# EAGLE design Arduino_MEGA2560_ref (EAGLE 9.1.1)
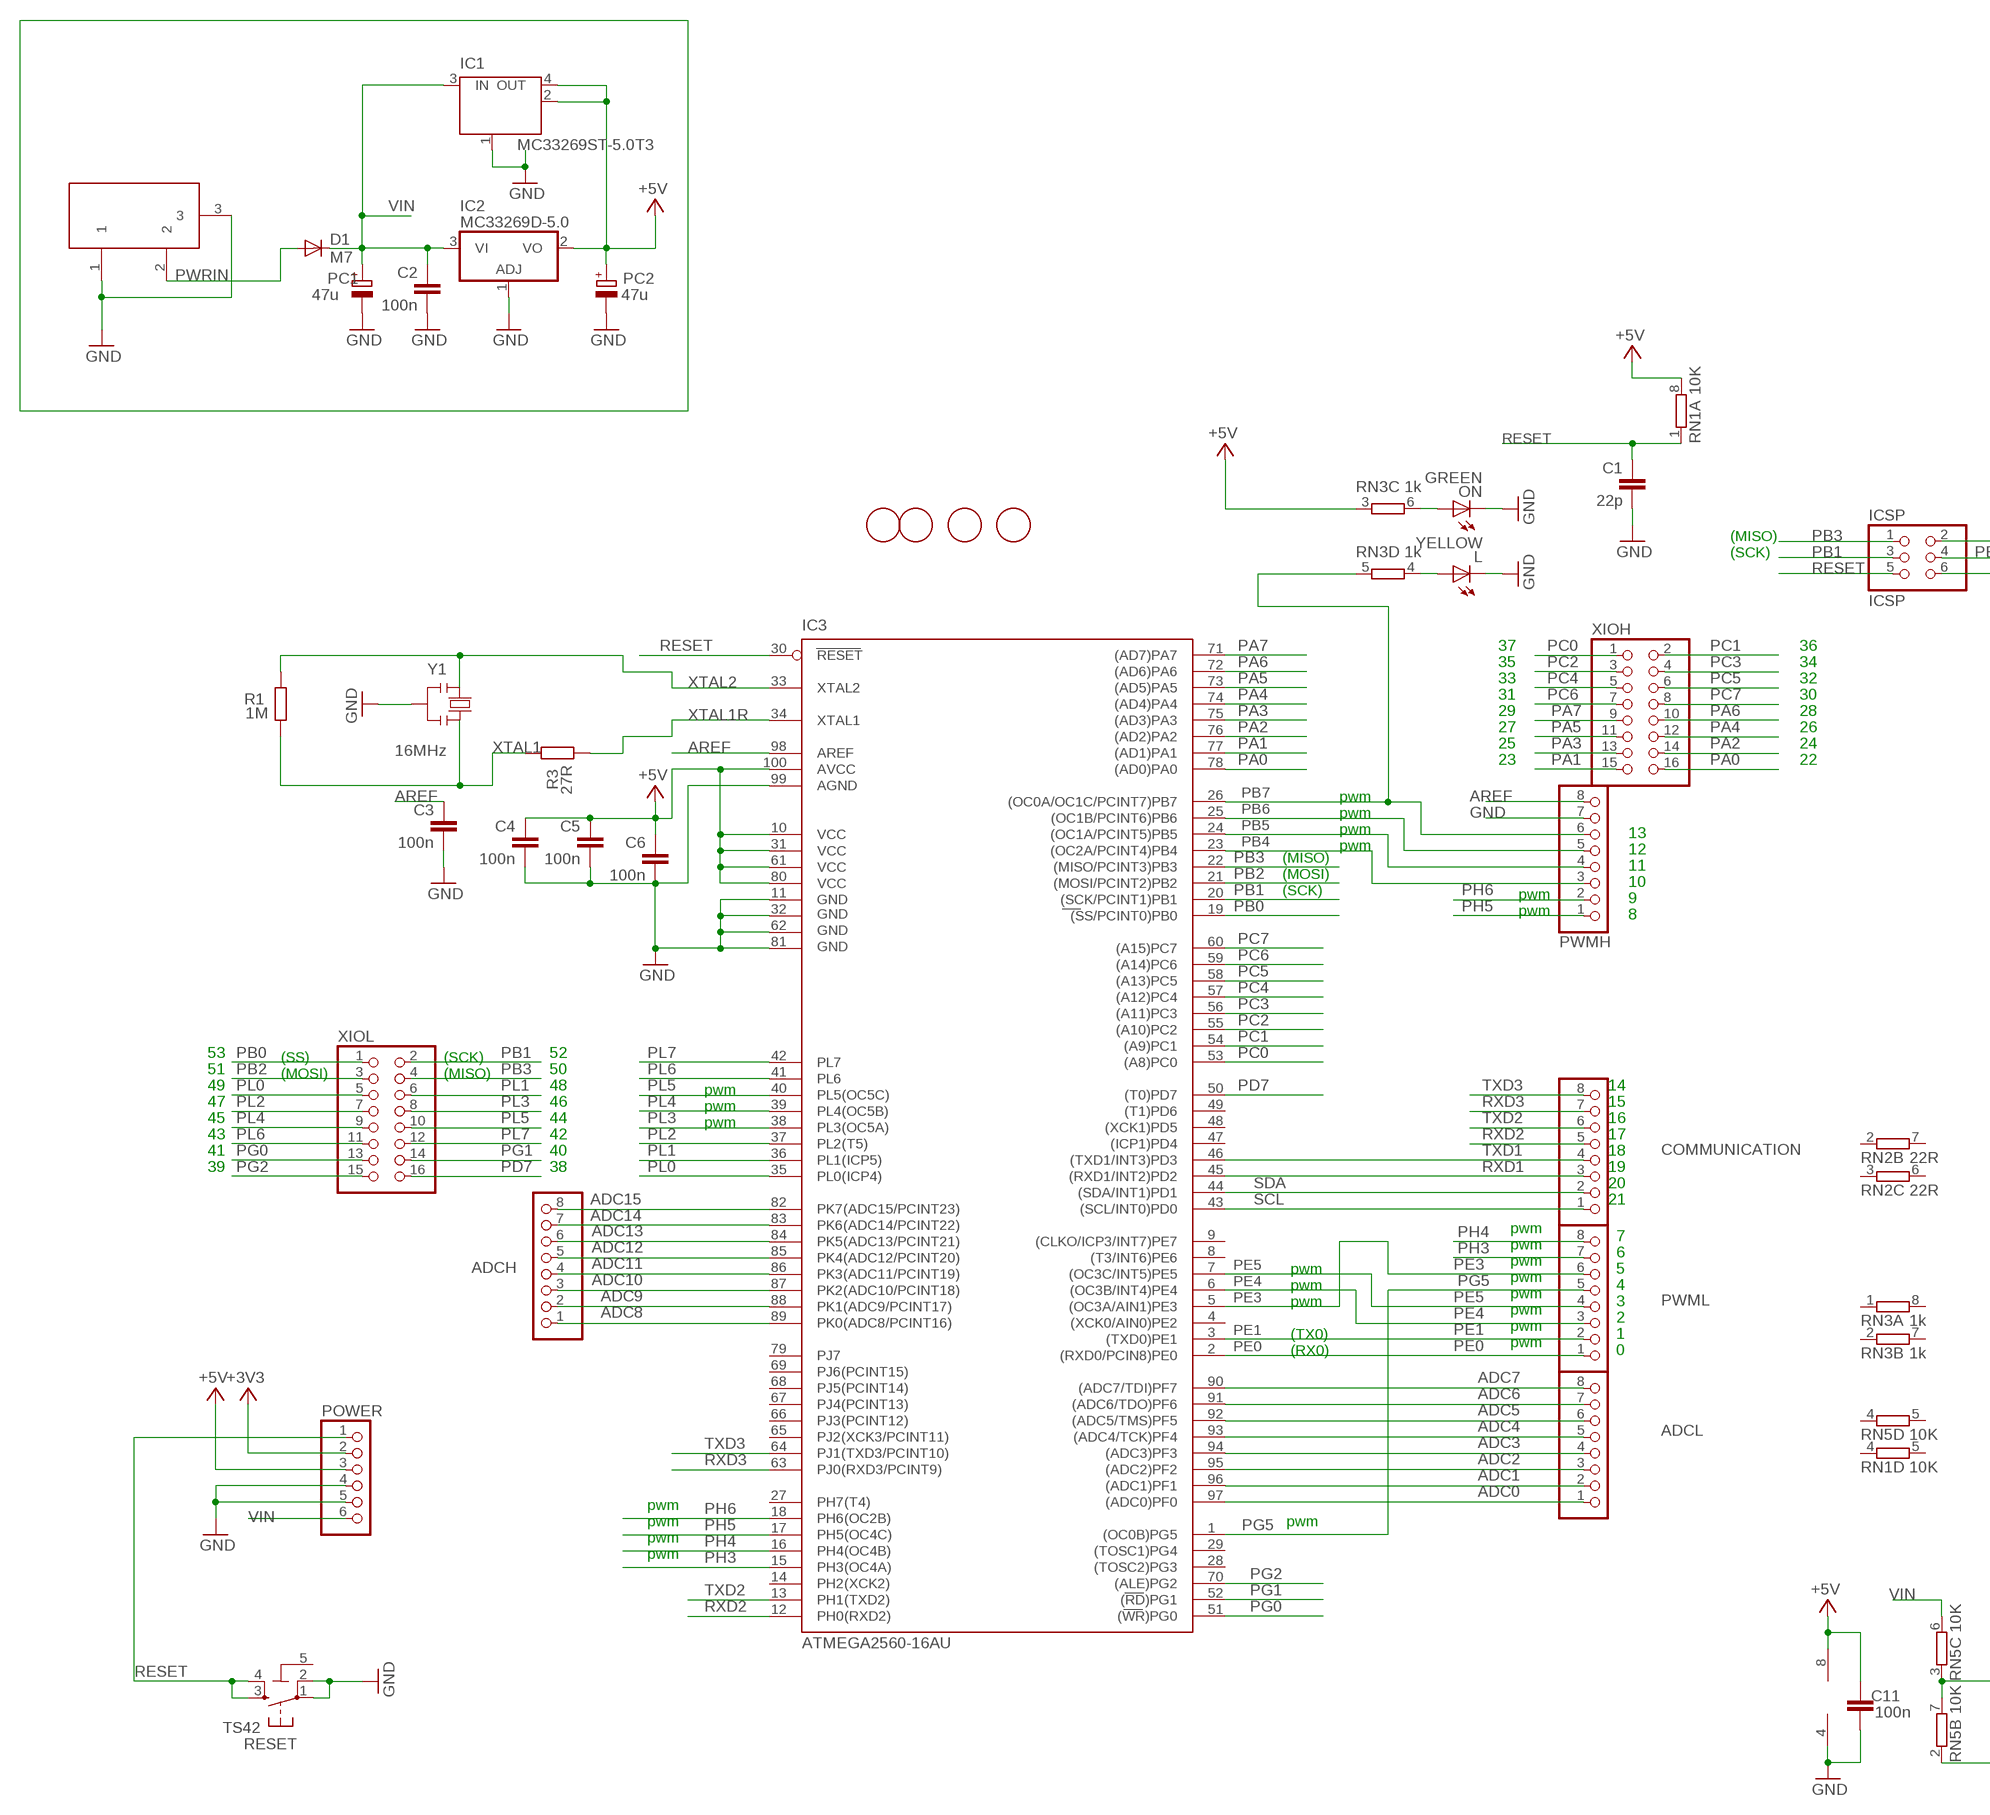
[diagram p0: schematic, sheet 1, part 1 of 2]
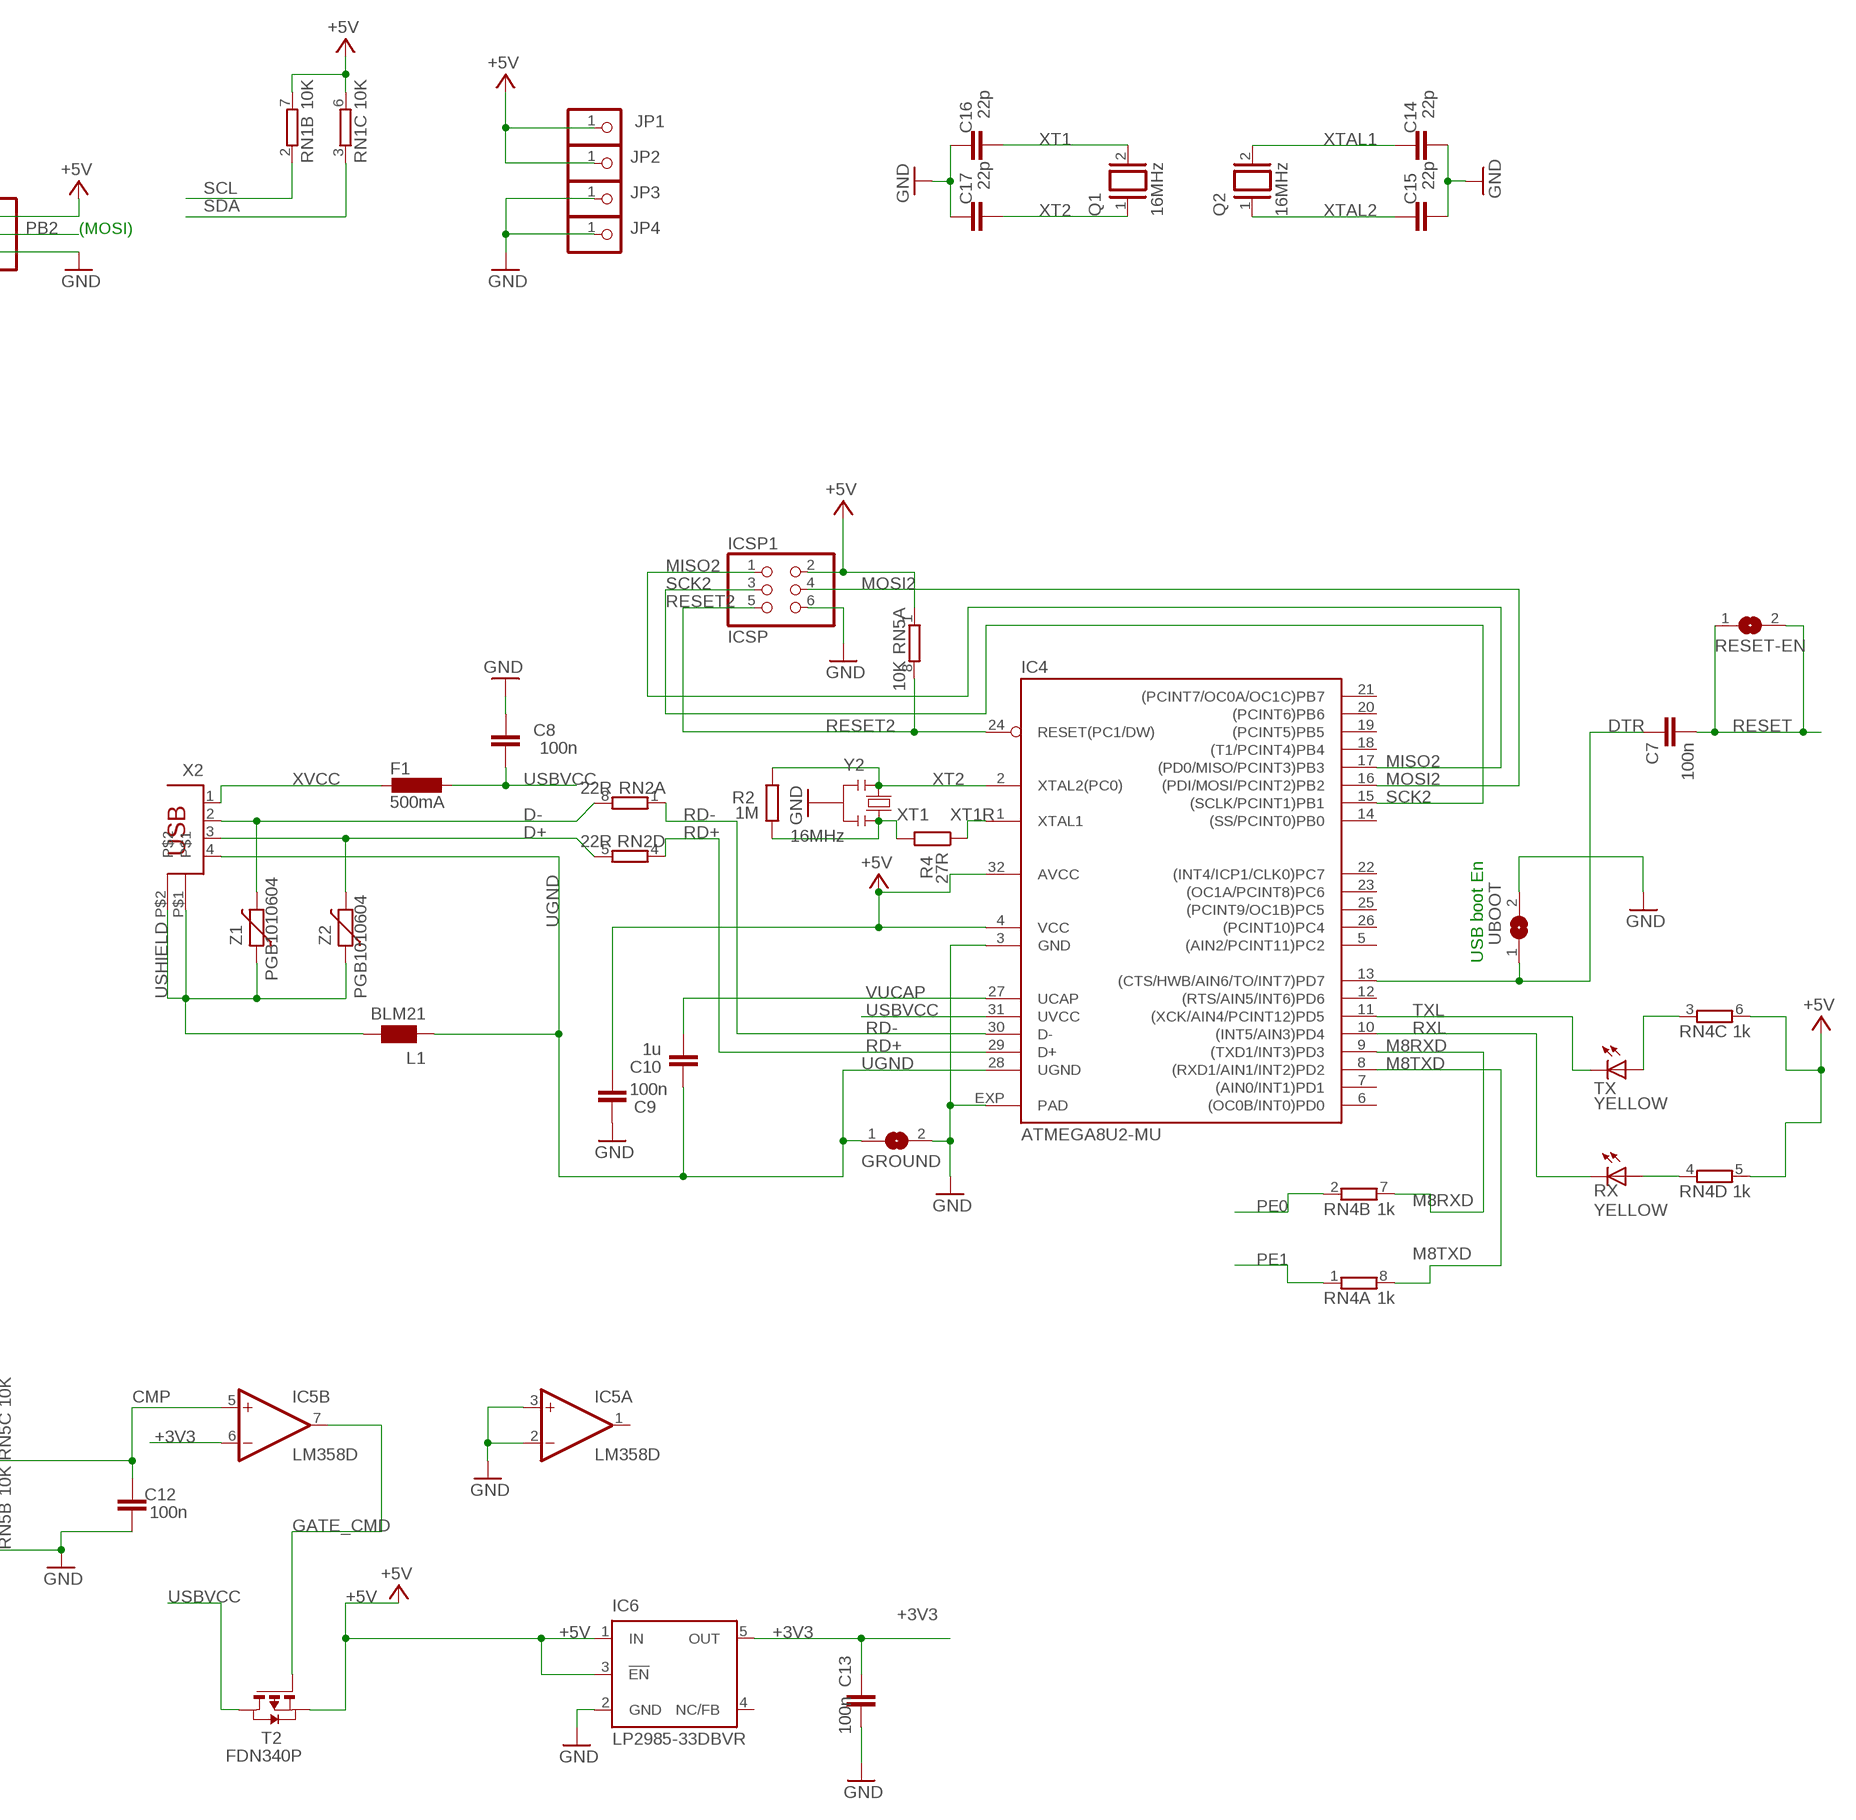
[diagram p1: schematic, sheet 1, part 2 of 2]

## Parts
ADCH  PINHD-1X8  [1X08]
ADCL  PINHD-1X8  [1X08]
C1  22p  C-EU0603-RND  [C0603-ROUND]
C2  100n  C-EU0603-RND  [C0603-ROUND]
C3  100n  C-EU0603-RND  [C0603-ROUND]
C4  100n  C-EU0603-RND  [C0603-ROUND]
C5  100n  C-EU0603-RND  [C0603-ROUND]
C6  100n  C-EU0603-RND  [C0603-ROUND]
C7  100n  C-EU0603-RND  [C0603-ROUND]
C8  100n  C-EUC0603  [C0603]
C9  100n  C-EU0603-RND  [C0603-ROUND]
C10  1u  C-EU0603-RND  [C0603-ROUND]
C11  100n  C-EUC0603  [C0603]
C12  100n  C-EU0603-RND  [C0603-ROUND]
C13  100n  C-EU0603-RND  [C0603-ROUND]
C14  22p  C-EU0603-RND  [C0603-ROUND]
C15  22p  C-EU0603-RND  [C0603-ROUND]
C16  22p  C-EU0603-RND  [C0603-ROUND]
C17  22p  C-EU0603-RND  [C0603-ROUND]
COMMUNICATION  PINHD-1X8  [1X08]
D1  M7  DIODE-SMB  [SMB]
F1  500mA  L-EUL1812  [L1812]
GROUND  SJ  [SJ]
IC1  MC33269ST-5.0T3  MC33269ST-3.3T3  [SOT223]
IC2  MC33269D-5.0  [DPACK]
IC3  ATMEGA2560-16AU  ATMEGA1280-16AU  [TQFP100]
IC4  ATMEGA8U2-MU  [QFN32]
IC5  LM358D  [SO08]
IC6  LP2985-33DBVR  TPS77033  [SOT23-DBV]
ICSP  ICSP  PINHD-2X3  [2X03]
ICSP1  ICSP  PINHD-2X3  [2X03]
JP1  PINHD-1X1  [1X01]
JP2  PINHD-1X1  [1X01]
JP3  PINHD-1X1  [1X01]
JP4  PINHD-1X1  [1X01]
L  YELLOW  LEDCHIP-LED0805  [CHIP-LED0805]
L1  BLM21  WE-CBF_0805  [0805]
ON  GREEN  LEDCHIP-LED0805  [CHIP-LED0805]
PC1  47u  CPOL-EUD  [PANASONIC_D]
PC2  47u  CPOL-EUD  [PANASONIC_D]
POWER  PINHD-1X6  [1X06]
PWMH  PINHD-1X8  [1X08]
PWML  PINHD-1X8  [1X08]
Q1  16MHz  XTAL/S  [QS]
Q2  16MHz  XTAL/S  [QS]
R1  1M  R-EU_R0603  [R0603-ROUND]
R2  1M  R-EU_R0603  [R0603-ROUND]
R3  27R  R-EU_R0603  [R0603-ROUND]
R4  27R  R-EU_R0603  [R0603-ROUND]
RESET  TS42  [TS42]
RESET-EN  SJ  [SJ]
RN1  10K  4R-NCAT16  [CAT16]
RN2  22R  4R-NCAY16  [CAY16]
RN3  1k  4R-NCAY16  [CAY16]
RN4  1k  4R-NCAY16  [CAY16]
RN5  10K  4R-NCAT16  [CAT16]
RX  YELLOW  LEDCHIP-LED0805  [CHIP-LED0805]
T2  FDN340P  PMOSSOT23  [SOT-23]
TX  YELLOW  LEDCHIP-LED0805  [CHIP-LED0805]
U$2  FIDUCIALMOUNT  [FIDUCIA-MOUNT]
U$3  FIDUCIALMOUNT  [FIDUCIA-MOUNT]
U$4  FIDUCIALMOUNT  [FIDUCIA-MOUNT]
U$5  FIDUCIALMOUNT  [FIDUCIA-MOUNT]
UBOOT  SJ  [SJ]
X1  DC21MMX  [DC-21MM]
X2  PN61729  [PN61729]
XIOH  PINHD-2X8  [2X08]
XIOL  PINHD-2X8  [2X08]
Y1  16MHz  RESONATORMU  [RESONATOR]
Y2  16MHz  RESONATORMU  [RESONATOR]
Z1  PGB1010604  VARISTORCN0603  [CT/CN0603]
Z2  PGB1010604  VARISTORCN0603  [CT/CN0603]

## Nets
+3V3: C13.2 IC5.6(B:-IN) IC6.5(OUT) POWER.2
+5V: C4.1 C5.1 C6.1 C9.1 C11.2 IC1.2(OUT) IC1.4(OUT) IC2.2(VO) IC3.10(VCC) IC3.31(VCC1) IC3.61(VCC2) IC3.80(VCC3) IC3.100(AVCC) IC4.4(VCC) IC4.32(AVCC) IC5.8(P:V+) IC6.1(IN) IC6.3(!EN) ICSP1.2 ICSP.2 JP1.1 JP2.1 PC2.+ POWER.3 RN1.6 RN1.7 RN1.8 RN3.3 RN4.5 RN4.6 RN5.1 T2.2(S)
ADC0: ADCL.1 IC3.97((ADC0)PF0)
ADC1: ADCL.2 IC3.96((ADC1)PF1)
ADC2: ADCL.3 IC3.95((ADC2)PF2)
ADC3: ADCL.4 IC3.94((ADC3)PF3)
ADC4: ADCL.5 IC3.93((ADC4/TCK)PF4)
ADC5: ADCL.6 IC3.92((ADC5/TMS)PF5)
ADC6: ADCL.7 IC3.91((ADC6/TDO)PF6)
ADC7: ADCL.8 IC3.90((ADC7/TDI)PF7)
ADC8: ADCH.1 IC3.89(PK0(ADC8/PCINT16))
ADC9: ADCH.2 IC3.88(PK1(ADC9/PCINT17))
ADC10: ADCH.3 IC3.87(PK2(ADC10/PCINT18))
ADC11: ADCH.4 IC3.86(PK3(ADC11/PCINT19))
ADC12: ADCH.5 IC3.85(PK4(ADC12/PCINT20))
ADC13: ADCH.6 IC3.84(PK5(ADC13/PCINT21))
ADC14: ADCH.7 IC3.83(PK6(ADC14/PCINT22))
ADC15: ADCH.8 IC3.82(PK7(ADC15/PCINT23))
AREF: C3.1 IC3.98(AREF) PWMH.8
CMP: C12.2 IC5.5(B:+IN) RN5.3 RN5.7
D+: RN2.5 X2.3 Z2.2
D-: RN2.8 X2.2 Z1.2
DTR: C7.1 IC4.13((CTS/HWB/AIN6/TO/INT7)PD7) UBOOT.1
GATE_CMD: IC5.7(B:OUT) T2.3(G)
GND: C1.2 C2.2 C3.2 C4.2 C5.2 C6.2 C8.2 C9.2 C11.1 C12.1 C13.1 C14.1 C15.1 C16.2 C17.2 GROUND.2 IC1.1(GND/ADJ) IC2.1(ADJ) IC3.11(GND) IC3.32(GND1) IC3.62(GND2) IC3.81(GND3) IC3.99(AGND) IC4.3(GND) IC4.EXP(PAD) IC5.2(A:-IN) IC5.3(A:+IN) IC5.4(P:V-) IC6.2(GND) ICSP1.6 ICSP.6 JP3.1 JP4.1 L.C ON.C PC1.- PC2.- POWER.4 POWER.5 PWMH.7 RESET.1 RESET.2 RN5.2 UBOOT.2 X1.1 X1.3 Y1.2 Y2.2
M8RXD: IC4.9((TXD1/INT3)PD3) RN4.7
M8TXD: IC4.8((RXD1/AIN1/INT2)PD2) RN4.8
MISO2: IC4.17((PD0/MISO/PCINT3)PB3) ICSP1.1
MOSI2: IC4.16((PDI/MOSI/PCINT2)PB2) ICSP1.4
N$2: L.A RN3.4
N$3: ON.A RN3.6
N$54: RN4.4 RX.A
N$55: RN4.3 TX.A
PA0: IC3.78((AD0)PA0) XIOH.16
PA1: IC3.77((AD1)PA1) XIOH.15
PA2: IC3.76((AD2)PA2) XIOH.14
PA3: IC3.75((AD3)PA3) XIOH.13
PA4: IC3.74((AD4)PA4) XIOH.12
PA5: IC3.73((AD5)PA5) XIOH.11
PA6: IC3.72((AD6)PA6) XIOH.10
PA7: IC3.71((AD7)PA7) XIOH.9
PB0: IC3.19((SS/PCINT0)PB0) XIOL.1
PB1: IC3.20((SCK/PCINT1)PB1) ICSP.3 XIOL.2
PB2: IC3.21((MOSI/PCINT2)PB2) ICSP.4 XIOL.3
PB3: IC3.22((MISO/PCINT3)PB3) ICSP.1 XIOL.4
PB4: IC3.23((OC2A/PCINT4)PB4) PWMH.3
PB5: IC3.24((OC1A/PCINT5)PB5) PWMH.4
PB6: IC3.25((OC1B/PCINT6)PB6) PWMH.5
PB7: IC3.26((OC0A/OC1C/PCINT7)PB7) PWMH.6 RN3.5
PC0: IC3.53((A8)PC0) XIOH.1
PC1: IC3.54((A9)PC1) XIOH.2
PC2: IC3.55((A10)PC2) XIOH.3
PC3: IC3.56((A11)PC3) XIOH.4
PC4: IC3.57((A12)PC4) XIOH.5
PC5: IC3.58((A13)PC5) XIOH.6
PC6: IC3.59((A14)PC6) XIOH.7
PC7: IC3.60((A15)PC7) XIOH.8
PD7: IC3.50((T0)PD7) XIOL.16
PE0: IC3.2((RXD0/PCIN8)PE0) PWML.1 RN4.2
PE1: IC3.3((TXD0)PE1) PWML.2 RN4.1
PE3: IC3.5((OC3A/AIN1)PE3) PWML.6
PE4: IC3.6((OC3B/INT4)PE4) PWML.3
PE5: IC3.7((OC3C/INT5)PE5) PWML.4
PG0: IC3.51((WR)PG0) XIOL.13
PG1: IC3.52((RD)PG1) XIOL.14
PG2: IC3.70((ALE)PG2) XIOL.15
PG5: IC3.1((OC0B)PG5) PWML.5
PH3: IC3.15(PH3(OC4A)) PWML.7
PH4: IC3.16(PH4(OC4B)) PWML.8
PH5: IC3.17(PH5(OC4C)) PWMH.1
PH6: IC3.18(PH6(OC2B)) PWMH.2
PL0: IC3.35(PL0(ICP4)) XIOL.5
PL1: IC3.36(PL1(ICP5)) XIOL.6
PL2: IC3.37(PL2(T5)) XIOL.7
PL3: IC3.38(PL3(OC5A)) XIOL.8
PL4: IC3.39(PL4(OC5B)) XIOL.9
PL5: IC3.40(PL5(OC5C)) XIOL.10
PL6: IC3.41(PL6) XIOL.11
PL7: IC3.42(PL7) XIOL.12
PWRIN: D1.A X1.2
RD+: IC4.29(D+) RN2.4
RD-: IC4.30(D-) RN2.1
RESET: C1.1 C7.2 IC3.30(RESET) ICSP.5 POWER.1 RESET-EN.1 RESET-EN.2 RESET.3 RESET.4 RN1.1
RESET2: IC4.24(RESET(PC1/DW)) ICSP1.5 RN5.8
RXD1: COMMUNICATION.3 IC3.45((RXD1/INT2)PD2)
RXD2: COMMUNICATION.5 IC3.12(PH0(RXD2))
RXD3: COMMUNICATION.7 IC3.63(PJ0(RXD3/PCINT9))
RXL: IC4.10((INT5/AIN3)PD4) RX.C
SCK2: IC4.15((SCLK/PCINT1)PB1) ICSP1.3
SCL: COMMUNICATION.1 IC3.43((SCL/INT0)PD0) RN1.2
SDA: COMMUNICATION.2 IC3.44((SDA/INT1)PD1) RN1.3
TXD1: COMMUNICATION.4 IC3.46((TXD1/INT3)PD3)
TXD2: COMMUNICATION.6 IC3.13(PH1(TXD2))
TXD3: COMMUNICATION.8 IC3.64(PJ1(TXD3/PCINT10))
TXL: IC4.11((XCK/AIN4/PCINT12)PD5) TX.C
UGND: C10.2 GROUND.1 IC4.28(UGND) L1.1 X2.4
USBVCC: C8.1 F1.1 IC4.31(UVCC) T2.1(D)
USHIELD: L1.2 X2.P$1 X2.P$2 Z1.1 Z2.1
VIN: C2.1 D1.C IC1.3(IN) IC2.3(VI) PC1.+ POWER.6 RN5.6
VUCAP: C10.1 IC4.27(UCAP)
XT1: C16.1 Q1.2 R2.1 R4.2 Y2.3
XT1R: IC4.1(XTAL1) R4.1
XT2: C17.1 IC4.2(XTAL2(PC0)) Q1.1 R2.2 Y2.1
XTAL1: C14.2 Q2.2 R1.1 R3.2 Y1.3
XTAL1R: IC3.34(XTAL1) R3.1
XTAL2: C15.2 IC3.33(XTAL2) Q2.1 R1.2 Y1.1
XVCC: F1.2 X2.1
Unconnected: IC3.4((XCK0/AIN0)PE2) IC3.8((T3/INT6)PE6) IC3.9((CLKO/ICP3/INT7)PE7) IC3.14(PH2(XCK2)) IC3.27(PH7(T4)) IC3.28((TOSC2)PG3) IC3.29((TOSC1)PG4) IC3.47((ICP1)PD4) IC3.48((XCK1)PD5) IC3.49((T1)PD6) IC3.65(PJ2(XCK3/PCINT11)) IC3.66(PJ3(PCINT12)) IC3.67(PJ4(PCINT13)) IC3.68(PJ5(PCINT14)) IC3.69(PJ6(PCINT15)) IC3.79(PJ7) IC4.5((AIN2/PCINT11)PC2) IC4.6((OC0B/INT0)PD0) IC4.7((AIN0/INT1)PD1) IC4.12((RTS/AIN5/INT6)PD6) IC4.14((SS/PCINT0)PB0) IC4.18((T1/PCINT4)PB4) IC4.19((PCINT5)PB5) IC4.20((PCINT6)PB6) IC4.21((PCINT7/OC0A/OC1C)PB7) IC4.22((INT4/ICP1/CLK0)PC7) IC4.23((OC1A/PCINT8)PC6) IC4.25((PCINT9/OC1B)PC5) IC4.26((PCINT10)PC4) IC5.1(A:OUT) IC6.4(NC/FB) RN1.4 RN1.5 RN2.2 RN2.3 RN2.6 RN2.7 RN3.1 RN3.2 RN3.7 RN3.8 RN5.4 RN5.5

## Notes on the sheet
- (MISO)
- (SCK) | (MOSI)
- 37 | 36
- 35 | 34
- 33 | 32
- 31 | 30
- 29 | 28
- 27 | 26
- 25 | 24
- 23 | 22
- pwm
- pwm
- pwm | 13
- pwm | 12
- (MISO)
- 11
- (MOSI)
- 10
- (SCK) | pwm
- 9
- pwm | 8
- 53 | (SS) | (SCK) | 52
- 51 | (MOSI) | (MISO) | 50
- 49 | 48 | pwm | 14
- 47 | 46 | pwm | 15
- 45 | 44 | pwm | 16
- 43 | 42 | 17
- 41 | 40 | 18
- 39 | 38 | 19
- 20
- 21
- USB boot En
- pwm
- 7
- pwm
- 6
- pwm
- pwm | 5
- pwm
- pwm | 4
- pwm
- pwm | 3
- pwm
- 2
- pwm
- (TX0) | 1
- pwm
- (RX0) | 0
- pwm
- pwm | pwm
- pwm
- pwm

## Power pins joined to a net without a drawn wire
5-GND: RESET.5(5-GND)

## Library data of the parts
ADCH ADCL COMMUNICATION PWMH PWML = pinhead:PINHD-1X8: PIN HEADER
C1-C7 C9 C10 C12-C17 = SmartPrj:C-EU: CAPACITOR, European symbol
C8 C11 = rcl:C-EU: CAPACITOR, European symbol
D1 = diode:DIODE-: DIODE
F1 = rcl:L-EU: INDUCTOR, European symbol
GROUND RESET-EN UBOOT = jumper:SJ: SMD solder JUMPER
IC1 = linear:MC33269ST*: Adjustable Output Low Dropout Voltage Regulator 800 mA Source: http://www.onsemi.com/pub/Collateral/MC33269-D.PDF
IC2 = linear:MC33269?*: Adjustable Output Low Dropout Voltage Regulator 800 mA Source: http://www.onsemi.com/pub/Collateral/MC33269-D.PDF
IC3 = atmel-2005:ATMEGA*: MICROCONTROLLER 64/128/256 Kbytes FLASH 4 Kbytes EEPROM 8 Kbytes SRAM 86 General Purpose I/O pins 12-channels16-bit PWM 4 x Serial USARTs 16-channels 10-bit A/D
IC4 = atmel:ATMEGA8U2-MU
IC5 = linear:LM358: OP AMP also LM158; LM258; LM2904 Source: http://cache.national.com/ds/LM/LM158.pdf
IC6 = texas:TPS770*: ULTRALOW-POWER 50-mA LOW-DROPOUT LINEAR REGULATORS 50-mA Low-Dropout Regulator Source: http://focus.ti.com/lit/ds/symlink/tps77001.pdf
ICSP ICSP1 = pinhead:PINHD-2X3: PIN HEADER
JP1-JP4 = pinhead:PINHD-1X1: PIN HEADER
L ON RX TX = led:LED: LED OSRAM: - CHIPLED LG R971, LG N971, LY N971, LG Q971, LY Q971, LO R971, LY R971 LH N974, LH R974 LS Q976, LO Q976, LY Q976 LO Q996 - Hyper CHIPLED LW Q18S LB Q993, LB Q99A, LB R99A - SideLED LS A670, LO A670, LY A670, LG A670, LP A670 LB A673, LV A673, LT A673, LW A673 LH A674 LY A675 LS A676, LA A676, LO A676, LY A676, LW A676 LS A679, LY A679, LG A679 - Hyper Micro SIDELED® LS Y876, LA Y876, LO Y876, LY Y876 LT Y87S - SmartLED LW L88C, LW L88S LB L89C, LB L89S, LG L890 LS L89K, LO L89K, LY L89K LS L896, LA L896, LO L896, LY L896 - TOPLED LS T670, LO T670, LY T670, LG T670, LP T670 LSG T670, LSP T670, LSY T670, LOP T670, LYG T670 LG T671, LOG T671, LSG T671 LB T673, LV T673, LT T673, LW T673 LH T674 LS T676, LA T676, LO T676, LY T676, LB T676, LH T676, LSB T676, LW T676 LB T67C, LV T67C, LT T67C, LS T67K, LO T67K, LY T67K, LW E67C LS E67B, LA E67B, LO E67B, LY E67B, LB E67C, LV E67C, LT E67C LW T67C LS T679, LY T679, LG T679 LS T770, LO T770, LY T770, LG T770, LP T770 LB T773, LV T773, LT T773, LW T773 LH T774 LS E675, LA E675, LY E675, LS T675 LS T776, LA T776, LO T776, LY T776, LB T776 LHGB T686 LT T68C, LB T68C - Hyper Mini TOPLED® LB M676 - Mini TOPLED Santana® LG M470 LS M47K, LO M47K, LY M47K Source: http://www.osram.convergy.de LUXEON: - LUMILED® LXK2-PW12-R00, LXK2-PW12-S00, LXK2-PW14-U00, LXK2-PW14-V00 LXK2-PM12-R00, LXK2-PM12-S00, LXK2-PM14-U00 LXK2-PE12-Q00, LXK2-PE12-R00, LXK2-PE12-S00, LXK2-PE14-T00, LXK2-PE14-U00 LXK2-PB12-K00, LXK2-PB12-L00, LXK2-PB12-M00, LXK2-PB14-N00, LXK2-PB14-P00, LXK2-PB14-Q00 LXK2-PR12-L00, LXK2-PR12-M00, LXK2-PR14-Q00, LXK2-PR14-R00 LXK2-PD12-Q00, LXK2-PD12-R00, LXK2-PD12-S00 LXK2-PH12-R00, LXK2-PH12-S00 LXK2-PL12-P00, LXK2-PL12-Q00, LXK2-PL12-R00 Source: www.luxeon.com KINGBRIGHT: KA-3528ASYC Source: www.kingbright.com
L1 = wuerth-elektronik:WE-CBF: SMD EMI Suppression Ferrite Beads - excellent anti-EMI properties - low DCR - impedances till 3000 ohms - rated current up to 6 A
PC1 PC2 = rcl:CPOL-EU: POLARIZED CAPACITOR, European symbol
POWER = pinhead:PINHD-1X6: PIN HEADER
Q1 Q2 = special:XTAL/S: CRYSTAL
R1-R4 = SmartPrj:R-EU_: RESISTOR, European symbol
RESET = st-mod v1.4:TS42: TS42 Dongnan Electronics Tact switch VDC 12V - 50mA
RN1-RN5 = resistor-dil:4R-N: Array Chip Resistor Source: RS Component / Phycomp
T2 = zetex:PMOSSOT23: MOS FET
U$2-U$5 = SmartPrj:FIDUCIALMOUNT
X1 = powersupply:DC21MM
X2 = SmartPrj:PN61729: BERG USB connector
XIOH XIOL = pinhead:PINHD-2X8: PIN HEADER
Y1 Y2 = SmartPrj:RESONATOR
Z1 Z2 = varistor:VARISTOR: VARISTOR

## Net classes
0 default: width 0.15 mm, drill 0.3 mm, clearance 0.15 mm

## Board
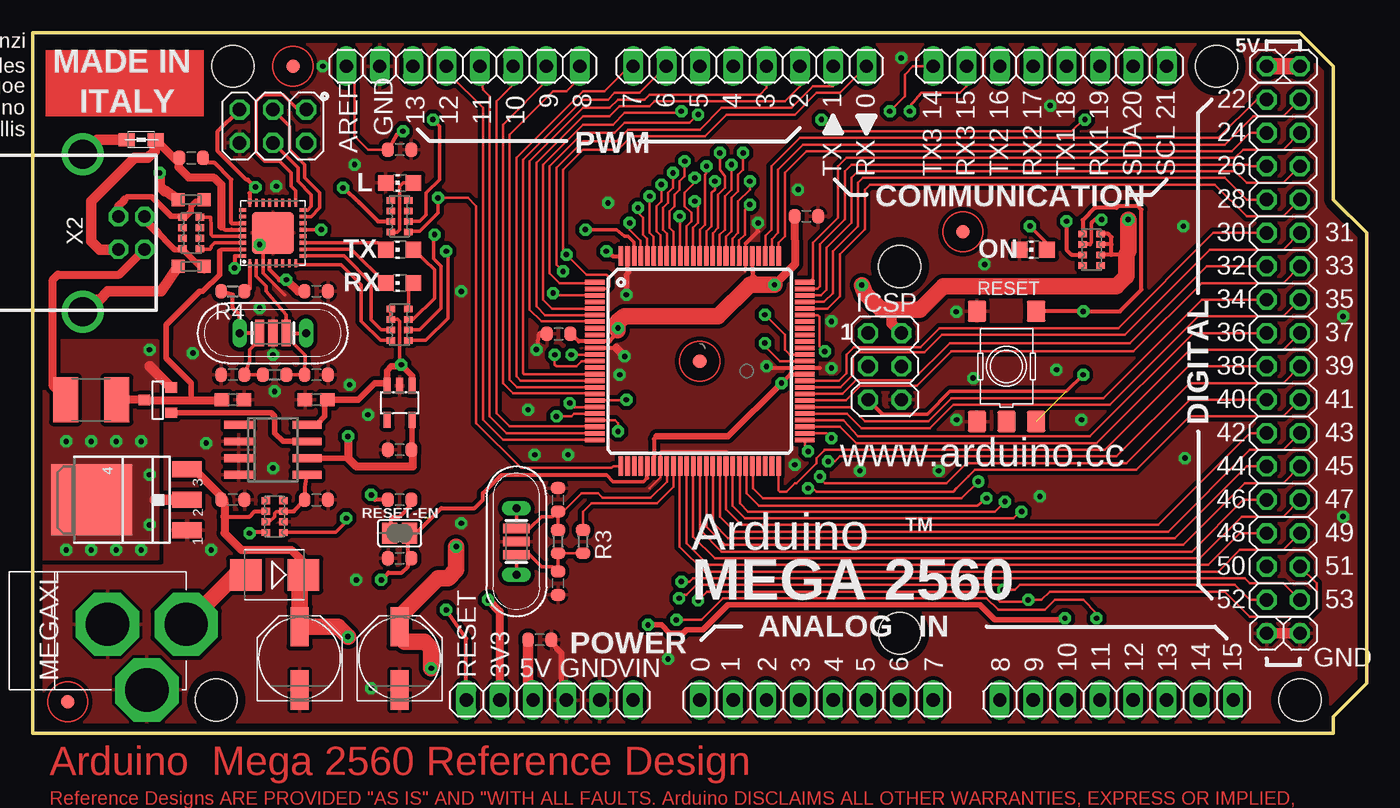
[diagram p2: board, top side]
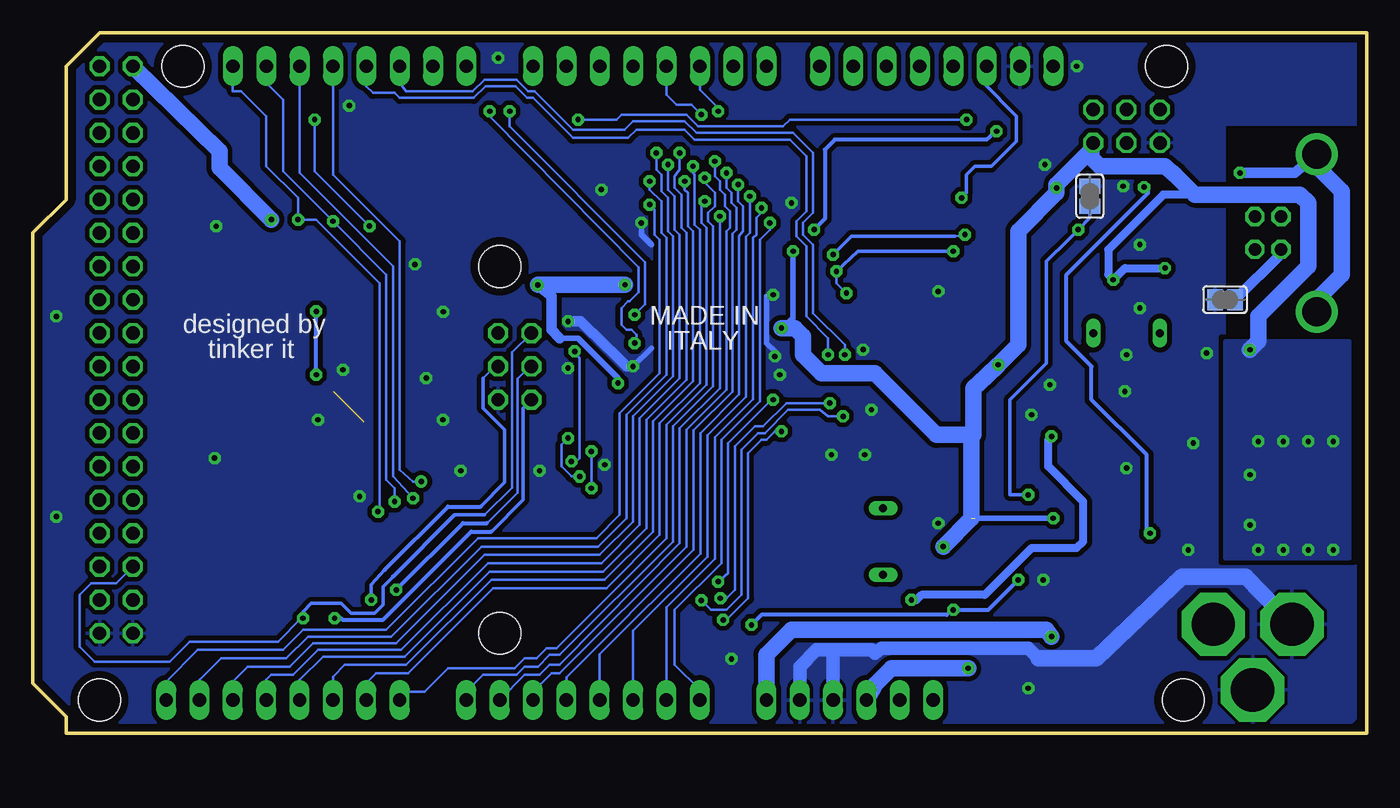
[diagram p3: board, bottom side, seen from below]

Size 101.6 x 53.34 mm. Coordinates in mm from the lower left corner, seen from the top.
Outline: 0,53.34 96.52,53.34 99.06,50.8 99.06,40.64 101.6,38.1 101.6,3.81 99.06,1.27 99.06,0 0,0 0,53.34
Copper layers (1*16): Top 0.035mm / dielectric 1.5mm / Bottom 0.035mm
Design rules "default *": minimum track width 0.15mm, minimum drill 0.3mm, track to track 0.15mm, track to pad 0.15mm, pad to pad 0.15mm, via to via 0.15mm, smd to smd 0.15mm, copper to edge 0.6mm, drill to drill 0.3mm, minimum pad ring 10mil, minimum via ring 10mil, stop-mask expansion 2mil, vias tented up to drill 1mil, thermal gap 10mil
Holes 3.2 mm at 96.52,2.54 15.24,50.8 90.17,50.8 13.97,2.54 66.04,35.56 66.04,7.62

### Footprints (pad centres in the part's own frame; a part is rotated, then mirrored left to right if it is on the bottom)
1X08 = drill 1.016 long: 1 -8.89,0; 2 -6.35,0; 3 -3.81,0; 4 -1.27,0; 5 1.27,0; 6 3.81,0; 7 6.35,0; 8 8.89,0
C0603-ROUND = smd 0.898 x 1.1: 1 -0.889,0; 2 0.889,0
C0603 = smd 1.1 x 1: 1 -0.85,0; 2 0.85,0
SMB = smd 2.4 x 2.4: A 2.2,0; C -2.2,0
L1812 = smd 1.9 x 3.4: 1 -1.95,0; 2 1.95,0
SJ = smd 1.168 x 1.6: 1 -0.762,0; 2 0.762,0
SOT223 = smd 1.219 x 2.235: 1 -2.311,-3.099; 2 0,-3.099; 3 2.311,-3.099 | smd 3.6 x 2.2: 4 0,3.099
DPACK = smd 1 x 1.6: 1 -2.28,-4.8; 3 2.28,-4.8 | smd 5.4 x 6.2: 2 0,2.5
TQFP100 = smd 1.5 x 0.35: 1 -8,6; 2 -8,5.5; 3 -8,5; 4 -8,4.5; 5 -8,4; 6 -8,3.5; 7 -8,3; 8 -8,2.5; 9 -8,2; 10 -8,1.5; 11 -8,1; 12 -8,0.5; 13 -8,0; 14 -8,-0.5; 15 -8,-1; 16 -8,-1.5; 17 -8,-2; 18 -8,-2.5; 19 -8,-3; 20 -8,-3.5; 21 -8,-4; 22 -8,-4.5; 23 -8,-5; 24 -8,-5.5; 25 -8,-6; 51 8,-6; 52 8,-5.5; 53 8,-5; 54 8,-4.5; 55 8,-4; 56 8,-3.5; 57 8,-3; 58 8,-2.5; 59 8,-2; 60 8,-1.5; 61 8,-1; 62 8,-0.5; 63 8,0; 64 8,0.5; 65 8,1; 66 8,1.5; 67 8,2; 68 8,2.5; 69 8,3; 70 8,3.5; 71 8,4; 72 8,4.5; 73 8,5; 74 8,5.5; 75 8,6 | smd 0.35 x 1.5: 26 -6,-8; 27 -5.5,-8; 28 -5,-8; 29 -4.5,-8; 30 -4,-8; 31 -3.5,-8; 32 -3,-8; 33 -2.5,-8; 34 -2,-8; 35 -1.5,-8; 36 -1,-8; 37 -0.5,-8; 38 0,-8; 39 0.5,-8; 40 1,-8; 41 1.5,-8; 42 2,-8; 43 2.5,-8; 44 3,-8; 45 3.5,-8; 46 4,-8; 47 4.5,-8; 48 5,-8; 49 5.5,-8; 50 6,-8; 76 6,8; 77 5.5,8; 78 5,8; 79 4.5,8; 80 4,8; 81 3.5,8; 82 3,8; 83 2.5,8; 84 2,8; 85 1.5,8; 86 1,8; 87 0.5,8; 88 0,8; 89 -0.5,8; 90 -1,8; 91 -1.5,8; 92 -2,8; 93 -2.5,8; 94 -3,8; 95 -3.5,8; 96 -4,8; 97 -4.5,8; 98 -5,8; 99 -5.5,8; 100 -6,8
QFN32 = smd 0.6 x 0.3: 1 -2.3,1.75; 2 -2.3,1.25; 3 -2.3,0.75; 4 -2.3,0.25; 5 -2.3,-0.25; 6 -2.3,-0.75; 7 -2.3,-1.25; 8 -2.3,-1.75; 17 2.3,-1.75; 18 2.3,-1.25; 19 2.3,-0.75; 20 2.3,-0.25; 21 2.3,0.25; 22 2.3,0.75; 23 2.3,1.25; 24 2.3,1.75 | smd 0.3 x 0.6: 9 -1.75,-2.3; 10 -1.25,-2.3; 11 -0.75,-2.3; 12 -0.25,-2.3; 13 0.25,-2.3; 14 0.75,-2.3; 15 1.25,-2.3; 16 1.75,-2.3; 25 1.75,2.3; 26 1.25,2.3; 27 0.75,2.3; 28 0.25,2.3; 29 -0.25,2.3; 30 -0.75,2.3; 31 -1.25,2.3; 32 -1.75,2.3 | smd 3.2 x 3.2: EXP 0,0
SO08 = smd 0.6 x 2.2: 1 -1.905,-2.6; 2 -0.635,-2.6; 3 0.635,-2.6; 4 1.905,-2.6; 5 1.905,2.6; 6 0.635,2.6; 7 -0.635,2.6; 8 -1.905,2.6
SOT23-DBV = smd 0.55 x 1.2: 1 -0.95,-1.3; 2 0,-1.3; 3 0.95,-1.3; 4 0.95,1.3; 5 -0.95,1.3
2X03 = drill 1.016 octagon: 1 -2.54,-1.27; 2 -2.54,1.27; 3 0,-1.27; 4 0,1.27; 5 2.54,-1.27; 6 2.54,1.27
1X01 = drill 1.016 octagon: 1 0,0
CHIP-LED0805 = smd 1.2 x 1.2: A 0,-1.05; C 0,1.05
0805 = smd 1.2 x 1: 1 -1.1,0; 2 1.1,0
PANASONIC_D = smd 3 x 1.4: + 2.4,0; - -2.4,0
1X06 = drill 1.016 long: 1 -6.35,0; 2 -3.81,0; 3 -1.27,0; 4 1.27,0; 5 3.81,0; 6 6.35,0
QS = drill 0.61 long: 1 -2.54,0; 2 2.54,0
R0603-ROUND = smd 0.898 x 1.1: 1 -0.889,0; 2 0.889,0
TS42 = smd 1.6 x 1.4: 1 -4.2,2.25; 2 4.2,2.25; 3 -4.2,-2.25; 4 4.2,-2.25; 5 -4.2,0
CAT16 = smd 0.5 x 0.65: 1 -1.2,-0.675; 2 -0.4,-0.675; 3 0.4,-0.675; 4 1.2,-0.675; 5 1.2,0.675; 6 0.4,0.675; 7 -0.4,0.675; 8 -1.2,0.675
CAY16 = smd 0.5 x 0.65: 1 -1.2,-0.675; 2 -0.4,-0.675; 3 0.4,-0.675; 4 1.2,-0.675; 5 1.2,0.675; 6 0.4,0.675; 7 -0.4,0.675; 8 -1.2,0.675
SOT-23 = smd 0.787 x 0.889: 1 0.025,-1.016; 2 -0.94,1.016; 3 0.991,1.016
FIDUCIA-MOUNT = smd 1.016 x 1.016: P$1 0,0
DC-21MM = drill 3.302 pad 4.826 octagon: 1 -5.08,-3.353; 2 -0.076,-6.35; 3 -0.076,-0.356
PN61729 = drill 0.95 octagon: 1 1.25,4.71; 2 -1.25,4.71; 3 -1.25,2.71; 4 1.25,2.71 | drill 2.2: P$1 -6,0; P$2 6,0
2X08 = drill 1.016 octagon: 1 -8.89,-1.27; 2 -8.89,1.27; 3 -6.35,-1.27; 4 -6.35,1.27; 5 -3.81,-1.27; 6 -3.81,1.27; 7 -1.27,-1.27; 8 -1.27,1.27; 9 1.27,-1.27; 10 1.27,1.27; 11 3.81,-1.27; 12 3.81,1.27; 13 6.35,-1.27; 14 6.35,1.27; 15 8.89,-1.27; 16 8.89,1.27
RESONATOR = smd 0.7 x 2: 1 -1,0; 2 0,0; 3 1,0
CT/CN0603 = smd 1 x 1: 1 -1,0; 2 1,0

### Placement (x,y rotation side)
ADCH  82.55,2.54 0 top
ADCL  59.69,2.54 0 top
C1  27.94,13.34 180 top
C2  15.24,17.78 0 top
C3  27.94,44.45 0 top
C4  38.61,7.11 0 top
C5  58.93,39.37 0 top
C6  40.05,30.42 180 top
C7  27.94,17.78 0 top
C8  15.24,25.4 0 top
C9  21.59,33.66 0 top
C10  12.06,43.81 180 top
C11  21.59,25.4 0 top
C12  21.59,17.78 180 top
C13  27.94,21.59 0 top
C14  40.01,11.43 90 top
C15  40.01,17.78 270 top
C16  15.24,27.3 180 top
C17  21.59,27.3 0 top
COMMUNICATION  77.47,50.8 180 top
D1  18.41,12.06 180 top
F1  4.45,25.4 180 top
GROUND  10.79,33.02 180 bottom
IC1  8.64,17.78 90 top
IC2  6.99,17.78 90 top
IC3  50.8,28.35 0 top
IC4  18.29,38.1 90 top
IC5  18.29,21.59 270 top
IC6  27.94,25.17 180 top
ICSP  64.9,27.94 270 top
ICSP1  18.29,46.23 180 top
JP1  93.98,50.8 0 top
JP2  96.52,50.8 0 top
JP3  93.98,7.62 0 top
JP4  96.52,7.62 0 top
L  27.94,41.91 90 top
L1  8.26,45.21 180 top
ON  76.2,36.83 90 top
PC1  20.32,5.71 90 top
PC2  27.94,5.71 90 top
POWER  39.37,2.54 0 top
PWMH  32.77,50.8 180 top
PWML  54.61,50.8 180 top
Q1  18.29,30.48 180 top
Q2  36.83,14.61 270 top
R1  40.01,14.61 90 top
R2  18.41,27.3 0 top
R3  41.91,14.61 270 top
R4  15.24,33.66 180 top
RESET  74.17,27.94 90 top
RESET-EN  27.94,15.24 0 top
RN1  80.64,36.83 270 top
RN2  12.06,38.1 90 top
RN3  27.94,39.37 270 top
RN4  27.94,31.11 90 top
RN5  18.41,16.51 90 top
RX  27.94,34.29 90 top
T2  9.53,25.4 270 top
TX  27.94,36.83 90 top
U$2  70.84,38.19 0 top
U$3  2.67,2.41 0 top
U$4  19.81,50.8 0 top
U$5  50.8,28.35 0 top
UBOOT  21.08,40.89 90 bottom
X1  5.33,8.38 90 top
X2  3.81,38.1 270 top
XIOH  95.25,39.37 90 top
XIOL  95.25,19.05 90 top
Y1  36.83,14.61 270 top
Y2  18.29,30.48 180 top
Z1  12.06,35.56 0 top
Z2  12.06,40.64 0 top

### Tracks (layer width: path | path; a pad name or v marks a point on that pad's centre or on a via)
+3V3  (via drill 0.41)
  Top 0.406: 28.89,21.62 IC6.5 | 24,20.95 IC5.6
  Top 0.61: POWER.2 35.56,9.27 v34.67,10.16 | 28.89,21.62 C13.2 28.96,21.55 28.96,20.32 24.64,20.32 24,20.95 v24,22.61
  Bottom 0.61: v34.67,10.16 34.29,10.16 33.91,10.54 29.08,10.54 25.53,14.1 22.1,14.1 21.59,14.61 21.59,17.65 24.26,20.32 24.26,22.35 v24,22.61
+5V  (via drill 0.41)  (1 unrouted)
  Top 0.254: IC3.80 54.81,36.3 54.79,36.27 54.81,36.25 54.81,35.41 | 57.66,27.3 57.7,27.35 | v28.07,28.07 28,28.19 27.94,28.64 27.94,31.37 27.79,31.52 RN4.6 RN4.5 | v23.88,16.38 23.88,16.13 23.06,15.31 RN5.1
  Top 0.305: 54.86,34.67 54.86,35.1 54.81,35.15 54.81,35.41 | 57.7,27.35 IC3.61 | v57.02,26.67 57.66,27.3 | 44.45,30.48 43.94,29.85 IC3.10 41.59,29.85 C6.1 | IC3.100 44.17,36.35 v43.69,36.7 | IC4.32 15.39,36.35 v15.37,35.43 | IC4.4 18.04,35.3 18.8,34.54 | RN1.8 81.92,38.03 82.17,37.78 82.17,37.21 | 83.31,36.45 82.17,36.45 | v23.62,41.53 24.89,40.39 26.29,38.99 27.25,38.99 RN3.3 | IC3.31 47.3,22.41 47.5,22.61 | RN1.6 82.15,36.43 82.17,36.45 | 82.17,36.45 82.17,37.21 | RN1.7 82.15,37.23 82.17,37.21
  Top 0.406: 44.55,30.7 44.45,30.48 v44.58,30.86 | IC5.8 21.65,23.55 22.23,24.13 22.23,25.18 C11.2 | v19.3,34.54 18.8,34.54
  Top 0.508: 47.5,22.61 52.96,22.61 v57.02,26.67 | C11.2 24.77,25.4 26.04,26.67 26.96,26.67 IC6.3 26.99,27.62 27.3,27.94 27.94,27.94 | IC6.1 28.89,27.24 v28.07,28.07
  Top 0.61: v28.07,28.07 27.94,27.94 | 54.86,34.67 54.86,34.29 54.99,34.16 | C5.1 58.08,35.75 v56.49,34.16 | C9.1 20.19,33.66 v19.3,34.54
  Top 0.813: 9.27,17.78 IC1.2 | C4.1 37.72,3.94 POWER.3 | 83.31,34.8 83.31,34.92 | 65.41,32.26 65.41,31.24 ICSP.2 | T2.2 10.49,26.34 8.89,27.94
  Top 1.27: JP1.1 JP2.1 | v63.14,34.14 63.37,33.53 64.64,32.26 65.41,32.26 67.56,32.26 69.34,34.04 82.55,34.04 83.31,34.8 | 83.31,34.92 83.31,36.45 83.44,36.7 v83.44,39.12 | 44.55,30.7 44.55,31.34 45.09,31.75 52.2,31.75 54.61,34.16 54.99,34.16 v56.49,34.16 | v32.26,14.22 32.26,12.45 31.62,11.81 30.86,11.81 27.94,8.89 PC2.+ 27.94,7.37 28.32,6.99 29.84,6.99 30.35,6.48 v30.35,4.95
  Bottom 0.254: 23.62,41.78 23.88,41.53
  Bottom 0.305: 15.37,43.18 14.48,43.05 | 23.88,41.53 v23.62,41.53
  Bottom 0.406: v44.58,30.86 44.58,30.73 43.69,31.62 v43.69,36.7 | 61.47,30.1 60.07,30.1 57.02,27.05 v57.02,26.67 | v23.88,16.38 29.84,16.38
  Bottom 0.61: 63.12,34.16 v63.14,34.14 | 13.08,41.02 15.49,41.02 19.68,36.83 19.68,34.92 v19.3,34.54 18.41,35.43 v15.37,35.43
  Bottom 0.813: 61.47,30.1 62.1,30.73 62.1,33.27 v63.14,34.14
  Bottom 1.27: v30.35,4.95 36.2,4.95 37.47,3.68 POWER.3 | v56.49,34.16 63.12,34.16 | v44.58,30.86 43.56,30.86 42.93,30.23 42.93,28.83 41.53,27.43 37.47,27.43 32.77,22.73 30.1,22.73 | JP1.1 87.38,44.32 87.38,43.05 v83.44,39.12 | 20.95,44.45 20.95,43.81 20.32,43.18 15.37,43.18 14.61,42.55 13.08,41.02 5.08,41.02 4.45,40.39 4.45,35.56 8.26,31.75 8.26,29.84 v8.89,29.21 | 20.95,44.45 20.95,44.83 ICSP1.2 | 20.95,44.45 23.62,41.78 23.62,41.15 26.54,38.23 26.54,29.59 v28.07,28.07 28.96,27.18 29.97,26.29 29.97,22.73 30.1,22.73 | 30.1,22.73 30.1,16.38 v32.26,14.22
  other vias: 6.35,22.23 4.45,22.23 8.26,22.23 2.54,22.23 8.89,19.68 2.54,13.97 6.35,13.97 4.45,13.97 8.89,15.88 8.26,13.97
  pour Top (isolate 0.305, no thermals): 9.53,13.34 9.53,29.84 0.64,29.84 0.64,13.34
  pour Bottom: 1.27,13.34 1.27,29.84 10.79,29.84 10.79,13.34
ADC0  (via drill 0.41)
  Top 0.203: IC3.97 46.3,37.52 45.47,38.35 v45.47,38.86
  Bottom 0.203: ADCL.1 50.8,3.3 52.7,5.21 52.7,9.4 49.15,12.95 49.15,22.35 46.23,25.27 46.23,37.59 45.47,38.35 v45.47,38.86
ADC1  (via drill 0.41)
  Top 0.203: IC3.96 46.8,37.66 46.48,37.97 46.48,39.24 46.1,39.62 v46.1,40.01
  Bottom 0.203: ADCL.2 53.34,9.6 49.63,13.31 49.63,22.55 46.74,25.45 46.74,37.72 46.48,37.97 46.48,39.24 46.1,39.62 v46.1,40.01
ADC2  (via drill 0.41)
  Top 0.203: v46.99,40.89 46.99,38.1 47.27,37.82 47.27,36.68 47.37,36.58 47.3,36.51 47.3,36.38 47.27,36.35 | 47.27,36.35 47.24,36.32 | 47.27,36.35 IC3.95
  Bottom 0.203: ADCL.3 55.88,7.8 50.22,13.46 50.22,22.68 47.27,25.63 47.27,37.82 46.99,38.1 v46.99,40.89
ADC3  (via drill 0.41)
  Top 0.203: IC3.94 47.8,37.92 47.5,38.23 47.5,40.13 47.88,40.51 v47.88,41.78
  Bottom 0.203: ADCL.4 58.42,2.74 58.52,2.85 58.52,3.05 58.42,3.15 58.42,6.02 50.75,13.69 50.75,22.86 47.8,25.81 47.8,37.85 47.75,37.97 47.5,38.23 47.5,40.13 47.88,40.51 v47.88,41.78
ADC4  (via drill 0.41)
  Top 0.203: IC3.93 48.3,38.06 48.01,38.35 48.01,40.01 48.39,40.39 48.39,41.15 48.77,41.53 v48.77,42.67
  Bottom 0.203: 60.96,2.44 ADCL.5 60.96,4.27 51.26,13.97 51.26,23.06 48.31,26.01 48.31,38.05 48.01,38.35 48.01,40.01 48.39,40.39 48.39,41.15 48.77,41.53 v48.77,42.67
ADC5  (via drill 0.41)
  Top 0.203: IC3.92 48.8,38.2 48.51,38.48 48.51,39.75 48.9,40.13 48.9,41.02 49.28,41.4 49.28,42.04 49.66,42.42 v49.66,43.56
  Bottom 0.203: v49.66,43.56 49.66,42.42 49.28,42.04 49.28,41.4 48.9,41.02 48.9,40.13 48.51,39.75 48.51,38.48 48.77,38.23 48.77,26.16 51.82,23.11 51.82,14.22 61.47,4.57 62.1,4.57 63.5,3.17 ADCL.6
ADC6  (via drill 0.41)
  Top 0.203: IC3.91 49.3,39.35 v49.28,39.37
  Bottom 0.203: v49.28,39.37 49.28,26.29 52.32,23.24 52.32,14.48 61.47,5.21 62.23,5.21 62.99,4.45 64.14,4.45 ADCL.7
ADC7  (via drill 0.41)
  Top 0.203: IC3.90 49.8,38.62 50.16,38.99 50.16,39.62 49.66,40.13 49.66,41.15 50.42,41.91 v50.42,42.29
  Bottom 0.203: v50.42,42.29 50.42,41.91 49.66,41.15 49.66,40.13 50.16,39.62 50.16,38.99 49.78,38.61 49.78,26.42 52.83,23.37 52.83,14.61 61.47,5.97 62.23,5.97 63.12,5.08 64.14,5.08 64.77,4.45 67.31,4.45 68.58,3.17 | 68.58,3.17 ADCL.8 | 68.58,3.17 68.58,3.94
ADC8  (via drill 0.41)
  Top 0.203: IC3.89 50.3,38.49 50.67,38.86 50.67,40.26 v50.42,40.51
  Bottom 0.203: v50.42,40.51 50.67,40.26 50.67,38.86 50.29,38.48 50.29,26.54 53.34,23.5 53.34,14.86 61.72,6.48 62.48,6.48 63.25,5.71 64.14,5.71 64.9,4.95 69.98,4.95 71.75,3.17 73.66,3.17 ADCH.1
ADC9  (via drill 0.41)
  Top 0.203: IC3.88 50.8,38.35 51.18,38.73 51.18,42.55 51.31,42.67 v51.31,43.18
  Bottom 0.203: v51.31,43.18 51.31,42.67 51.18,42.55 51.18,38.73 50.8,38.35 50.8,26.67 53.85,23.62 53.85,15.11 57.91,11.05 66.55,11.05 73.03,4.57 75.44,4.57 76.2,3.81 ADCH.2
ADC10  (via drill 0.41)
  Top 0.203: IC3.87 51.3,38.22 51.69,38.61 51.69,41.15 51.94,41.4 v51.94,42.04
  Bottom 0.203: v51.94,42.04 51.94,41.4 51.69,41.15 51.69,38.61 51.31,38.23 51.31,26.8 54.36,23.75 54.36,15.37 58.04,11.68 66.67,11.68 73.15,5.21 77.85,5.21 78.74,4.32 ADCH.3
ADC11  (via drill 0.41)
  Top 0.203: IC3.86 51.8,38.08 52.2,38.48 52.2,41.02 52.7,41.53 52.7,42.42 52.32,42.93 v52.32,44.2
  Bottom 0.203: v52.32,44.2 52.32,42.93 52.7,42.42 52.7,41.53 52.2,41.02 52.2,38.48 51.82,38.1 51.82,26.92 54.86,23.88 54.86,15.62 58.17,12.32 66.8,12.32 73.28,5.84 79.5,5.84 81.28,4.06 ADCH.4
ADC12  (via drill 0.41)
  Top 0.203: IC3.85 52.3,37.95 52.7,38.35 52.7,40.89 53.21,41.4 v53.21,43.31
  Bottom 0.203: v53.21,43.31 53.21,41.4 52.7,40.89 52.7,38.35 52.32,37.97 52.32,27.05 55.37,24 55.37,15.88 58.29,12.95 66.93,12.95 73.53,6.35 79.88,6.35 81.79,4.45 83.44,4.45 83.82,4.06 ADCH.5
ADC13  (via drill 0.41)
  Top 0.203: IC3.84 52.8,37.81 53.21,38.23 53.21,40.77 53.72,41.27 53.72,42.55 54.1,42.93 v54.1,44.2
  Bottom 0.203: v54.1,44.2 54.1,42.93 53.72,42.55 53.72,41.27 53.21,40.77 53.21,38.23 52.83,37.85 52.83,27.18 55.88,24.13 55.88,16.13 58.42,13.59 67.18,13.59 73.91,6.86 80.26,6.86 82.04,5.08 85.22,5.08 86.36,3.94 ADCH.6
ADC14  (via drill 0.41)
  Top 0.203: IC3.83 53.3,37.68 53.72,38.1 53.72,40.51 54.61,41.4 v54.61,42.04
  Bottom 0.203: v54.61,42.04 54.61,41.4 53.72,40.51 53.72,38.1 53.34,37.72 53.34,27.3 56.39,24.26 56.39,16.38 58.55,14.22 67.44,14.22 74.3,7.37 80.64,7.37 82.3,5.71 87.25,5.71 88.9,4.06 ADCH.7
ADC15  (via drill 0.41)
  Top 0.203: IC3.82 53.8,37.54 54.23,37.97 54.23,39.88 v54.61,40.26
  Bottom 0.203: v54.61,40.26 54.23,39.88 54.23,37.97 53.85,37.59 53.85,27.43 56.9,24.38 56.9,16.64 58.67,14.86 67.69,14.86 74.68,7.87 81.03,7.87 82.55,6.35 89.03,6.35 91.44,3.94 ADCH.8
AREF  (via drill 0.41)
  Top 0.203: C3.1 25.53,44.45 24.51,45.47 24.51,49.4 PWMH.8
  Top 0.254: IC3.98 45.8,37.38 45.34,37.85 45.09,37.85 44.45,38.35 v42.09,38.35
  Top 0.305: v28.19,45.85 27.73,45.59 C3.1
  Bottom 0.305: PWMH.8 24.13,50.55 | v28.19,45.85 28.96,45.21 40.51,45.21 41.27,44.45 41.27,39.17 v42.09,38.35
CMP
  Top 0.254: RN5.7 18.02,16.11 18.41,16.51 18.41,16.76 18.54,16.89 19.07,16.89
  Top 0.305: IC5.5 20.74,18.77 C12.2 19.87,16.91 RN5.3 19.07,16.89
D+
  Top 0.406: 6.99,40.64 7.2,40.85 9.06,40.85 10.54,39.37 11.32,39.37 RN2.5 11.61,39.3 12.06,39.75 12.06,40.13 12.45,40.51 12.94,40.51 Z2.2
  Top 0.61: X2.3 6.52,40.17 6.99,40.64
D-
  Top 0.406: 9.53,38.1 9.56,38.1 10.03,37.63 10.03,37.59 10.79,36.83 11.32,36.83 RN2.8 13.06,35.23 Z1.2
  Top 0.61: X2.2 8.53,39.1 9.53,38.1
DTR  (via drill 0.41)
  Top 0.254: v21.97,38.35 IC4.13
  Top 0.305: C7.1 26.04,17.78 v25.78,18.16
  Bottom 0.254: v25.78,18.16 27.18,18.16 27.18,25.4 24.38,28.19 24.38,35.94 22.73,37.59 22.73,37.58 v21.97,38.35 21.08,39.24 UBOOT.1
GATE_CMD
  Top 0.406: T2.3 18.14,24.41 18.41,24.13 18.41,22.86 19.05,22.23 IC5.7
GND  (via drill 0.41)
  Top 0.203: 54.23,35.18 54.3,35.25 IC3.81 54.33,36.35 | 54.3,37.28 54.3,36.38 54.33,36.35 | IC3.32 47.8,21.39 47.88,21.46 52.83,21.46 | IC3.32 | IC3.32 47.8,19.48 46.99,18.67 | 54.33,36.35 54.36,36.32
  Top 0.254: 17.54,37.35 IC4.3 17.54,35.04 19.18,33.4
  Top 0.305: 45.39,35.1 45.29,35.2 IC3.99 | IC3.11 42.86,29.35 42.88,29.36 44.32,29.36 | 44.32,29.36 44.4,29.36 | 56.06,27.86 56.08,27.84 58.81,27.84 | 58.83,27.84 58.82,27.85 IC3.62 58.81,27.84 | 54.3,37.28 55.24,38.23 v55.24,38.86 | 44.32,29.36 44.32,29.34 44.35,29.36 44.42,29.36 | v38.35,29.23 38.61,30.48 | 59.94,27.81 59.92,27.84 58.81,27.84 | v17.27,37.21 IC4.EXP
  Top 0.406: C4.2 39.88,6.48 40.26,6.1 40.26,3.94 POWER.4 | 56.06,27.86 56.01,27.81 v55.88,27.94 | v45.21,33.4 45.21,34.92 45.39,35.1 | v17.27,37.21 17.53,37.21 18.41,38.1
  Top 0.61: v55.88,27.94 55.88,27.81 | 44.42,29.36 v45.09,28.7
  Top 0.813: JP3.1 JP4.1
  Bottom 0.305: GROUND.2 10.16,33.02
  Bottom 0.406: v45.09,28.7 45.09,29.08 45.72,29.72 45.72,33.27 v45.21,33.4 | v55.24,38.86 55.24,37.97 54.48,37.21 | v55.88,27.94 54.48,29.34
  Bottom 0.813: v60.83,31.37 59.87,31.37 58.98,30.48 58.93,30.48 56.39,27.94 v55.88,27.94 | 93.73,7.87 JP3.1
  Bottom 1.016: 25.02,5.71 25.78,6.48 36.96,6.48 37.47,6.1 37.72,6.35 40.64,6.35 | POWER.5 43.18,5.08 41.91,6.35 40.64,6.35 | 40.64,6.35 POWER.4
  Bottom 1.27: 25.02,5.71 20.57,5.71 14.1,11.94 9.2,11.94 X1.3
  other vias: 18.41,26.04 69,20 38.23,21.21 32.64,33.66 87.63,38.61 87.76,20.95 72.49,35.71 24.64,11.68 13.59,13.97 32.64,16 40.77,21.21 18.54,41.66 25.53,24.26 58.29,41.4 77.5,47.8 43.81,40.39 44.7,27.3 48.39,5.67 25.78,3.43 13.21,22.1 24.13,26.54 24.51,43.31 60.83,27.81 58.04,20.45 12.19,28.96 37.72,24.64 77.98,27.69 76.71,18.04 99.81,31.75 79.88,23.88 70.36,23.88 71.63,27.05 18.29,28.83 70.34,32.1 63,20 17.27,32.38 99.81,16.51 66.15,51.44 22.08,50.8 18.29,20.19
  pour Top (isolate 0.305, rank 2): 0.64,52.7 101.6,52.7 101.6,0.64 0.64,0.64 0.64,29.84 10.79,29.84 10.79,46.35 0.64,46.35
  pour Bottom (isolate 0.356, rank 2): 0.64,52.7 101.6,52.7 102.23,52.07 102.23,0.64 1.27,0.64 0.64,1.27 0.64,29.84 10.79,29.84 10.79,46.35 0.64,46.35
M8RXD
  Top 0.254: IC4.9 23.72,36.35 25.78,34.29 25.78,31.5 26.54,30.73 27.25,30.73 RN4.7
M8TXD
  Top 0.254: RN4.8 26.47,29.91 25.02,31.37 25.02,34.16 23.5,35.69 20.15,35.69 IC4.8
MISO2
  Top 0.254: IC4.17 20.04,41.3 19.68,41.66 19.68,42.67 18.8,43.56 17.65,43.56 17.02,44.2 17.02,48.13 17.53,48.64 19.05,48.64 20.19,47.5 ICSP1.1
MOSI2
  Top 0.254: IC4.16 20.93,39.85 21.21,40.13 21.21,41.02 20.19,42.04 20.19,43.05 ICSP1.4
N$2
  Top 0.254: RN3.4 27.76,38.17 27.94,38.35 27.94,41.66 28.19,41.91 L.A
N$3  (via drill 0.41)
  Top 0.203: 77.22,37.08 ON.A | v80.14,46.74 80.01,46.74 79.12,45.85 60.96,45.85 v60.07,46.74
  Top 0.254: v30.48,46.74 30.99,46.23 30.99,42.16 29.97,41.15 29.97,39.5 29.46,38.99 28.63,38.99 RN3.6 | 77.22,37.08 77.22,37.37 v75.96,38.62
  Bottom 0.203: v75.96,38.62 80.14,42.8 v80.14,46.74 | v60.07,46.74 57.15,46.74 56.77,47.12 51.82,47.12 50.93,46.23 44.45,46.23 43.94,46.74 v30.48,46.74
N$54
  Top 0.254: RN4.4 28.61,33.82 RX.A
N$55
  Top 0.254: RN4.3 28.98,31.52 30.61,33.15 30.61,35.31 TX.A
PA0
  Top 0.203: IC3.78 55.8,37.89 56.26,38.35 56.26,43.18 58.42,45.34 90.3,45.34 93.22,48.26 XIOH.16
PA1
  Top 0.203: IC3.77 56.3,37.63 56.77,38.1 56.77,42.93 58.67,44.83 90.81,44.83 92.96,46.99 95.25,46.99 XIOH.15
PA2
  Top 0.203: XIOH.14 92.71,45.72 91.31,44.32 58.93,44.32 57.28,42.67 57.28,37.85 56.8,37.37 IC3.76
PA3
  Top 0.203: XIOH.13 95.25,44.45 92.2,44.45 91.57,43.81 61.98,43.81 61.34,43.18 61.34,39.26 59.44,37.35 59.44,34.67 59.11,34.35 IC3.75
PA4
  Top 0.203: IC3.74 59.75,33.85 59.94,34.04 59.94,37.23 61.85,39.13 61.85,42.8 62.36,43.31 92.58,43.31 92.71,43.18 XIOH.12
PA5
  Top 0.203: IC3.73 60.02,33.35 60.45,33.78 60.45,36.97 62.36,38.88 62.36,42.29 62.87,42.8 91.57,42.8 92.46,41.91 95.25,41.91 XIOH.11
PA6
  Top 0.203: IC3.72 60.28,32.85 60.96,33.53 60.96,36.72 62.87,38.62 62.87,41.91 63.25,42.29 90.81,42.29 92.46,40.64 XIOH.10
PA7
  Top 0.203: IC3.71 60.54,32.35 61.47,33.27 61.47,36.47 63.37,38.37 63.37,41.4 63.75,41.78 90.04,41.78 92.46,39.37 95.25,39.37 XIOH.9
PB0  (via drill 0.41)
  Top 0.203: IC3.19 45.39,25.35 v45.21,25.4 | v49.4,11.56 50.04,11.56 50.29,11.81 92.33,11.81 92.71,11.43 95.25,11.43 XIOL.1
  Bottom 0.203: v45.21,25.4 45.34,25.4 48.64,22.1 48.64,12.19 v49.4,11.56
PB1  (via drill 0.41)
  Top 0.203: IC3.20 41.19,24.85 v40.89,25.15 | XIOL.2 92.71,10.16 91.57,11.3 75.18,11.3 74.8,10.92 v73.91,10.92 73.53,11.3 50.55,11.3 49.78,10.54 49.48,10.54 v49.23,10.29
  Bottom 0.203: v40.89,25.15 44.2,25.15 45.97,23.37 46.61,23.37 48.13,21.84 48.13,10.92 48.77,10.29 v49.23,10.29 | 63.75,27.94 64.69,27 64.69,18.31 67,16
  Bottom 0.254: 63.75,27.94 ICSP.3
  Bottom 0.305: 67,16 68.83,16 v73.91,10.92
PB2  (via drill 0.41)
  Top 0.203: IC3.21 41.24,24.35 41.02,24.13 v39.88,24.13 | XIOL.3 97.79,11.43 97.79,9.53 97.16,8.89 92.71,8.89 90.81,10.79 77.47,10.79 76.83,10.16 v75.82,10.16 75.69,10.03 73.66,10.03 72.9,10.79 51.34,10.79 v50.67,10.12
  Bottom 0.203: v39.88,24.13 41.02,24.13 41.66,24.64 44.07,24.64 45.85,22.86 46.35,22.86 47.62,21.59 47.62,10.54 48.77,9.4 49.95,9.4 v50.67,10.12 | ICSP.4 66.42,27.94 67.31,27.05
  Bottom 0.254: 67.31,27.05 67.31,24.77 65.66,23.11 65.66,19.11 67.49,17.27 | 74.8,12.45 75.82,11.3 v75.82,10.16
  Bottom 0.305: 67.49,17.27 69.98,17.27 74.8,12.45
PB3  (via drill 0.41)
  Top 0.203: IC3.22 44.35,23.85 44.58,23.62 v44.58,22.99 | v81.03,8.76 81.03,9.14 80.01,10.16 77.85,10.16 77.09,9.4 73.53,9.4 72.64,10.29 52.58,10.29 50.93,8.64 v49.02,8.64
  Bottom 0.203: v81.03,8.76 81.15,8.76 82.93,6.99 89.66,6.99 91.19,5.46 96.9,5.46 98.04,6.6 98.04,10.54 97.16,11.43 95.25,11.43 XIOL.4 | v44.58,22.99 45.09,22.99 45.72,22.35 46.1,22.35 47.12,21.34 47.12,10.29 48.77,8.64 v49.02,8.64 | ICSP.1 65.1,29.01 65.1,18.72 67.18,16.64
  Bottom 0.254: v81.03,8.76 81.03,9.27 80.39,9.91 78.11,9.91 77.34,9.14 75.56,9.14 74.93,9.78 74.93,11.18 74.17,11.94 | 69.47,16.64 67.18,16.64
  Bottom 0.305: 74.17,11.94 69.47,16.64
PB4
  Top 0.203: PWMH.3 36.83,49.66 35.31,48.13 35.31,24.38 36.32,23.37 42.93,23.37 42.9,23.35 IC3.23
PB5
  Top 0.203: IC3.24 36.08,22.85 34.8,24.13 34.8,48.51 34.29,49.02 PWMH.4
PB6
  Top 0.203: IC3.25 42.92,22.35 42.93,22.35 35.81,22.35 34.29,23.88 34.29,47.62 31.75,50.16 PWMH.5
PB7  (via drill 0.41)
  Top 0.203: IC3.26 44.22,20.34 44.09,20.22 37.19,20.22 33.78,23.62 33.78,40.13 33.15,40.77 v30.86,40.77
  Top 0.254: v30.86,40.77 30.86,39.62 29.46,38.23 28.67,38.23 RN3.5
  Bottom 0.254: PWMH.6 29.21,49.53 26.67,46.99 26.67,45.09 28.57,43.18 29.84,43.18 30.48,42.55 30.48,41.15 v30.86,40.77
PC0
  Top 0.203: IC3.53 61.49,23.35 62.74,22.1 81.03,22.1 88.14,29.21 95.25,29.21 XIOH.1
PC1
  Top 0.203: IC3.54 61.75,23.85 62.87,22.61 80.52,22.61 88.39,30.48 XIOH.2
PC2
  Top 0.203: IC3.55 62.01,24.35 63.12,23.24 68.33,23.24 70.1,25.02 82.04,25.02 88.77,31.75 95.25,31.75 XIOH.3
PC3
  Top 0.203: IC3.56 62.28,24.85 63.37,23.75 68.2,23.75 69.98,25.53 81.53,25.53 89.03,33.02 XIOH.4
PC4
  Top 0.203: IC3.57 61.92,25.35 63.04,26.47 67.36,26.47 69.98,29.08 83.82,29.08 89.03,34.29 95.25,34.29 XIOH.5
PC5
  Top 0.203: IC3.58 61.66,25.85 62.69,26.87 67,26.87 69.85,29.72 83.57,29.72 89.41,35.56 XIOH.6
PC6
  Top 0.203: IC3.59 61.52,26.35 62.48,27.3 62.48,28.7 62.79,29.01 67.89,29.01 69.24,30.35 83.19,30.35 89.66,36.83 95.25,36.83 XIOH.7
PC7
  Top 0.203: IC3.60 61.39,26.85 61.98,27.43 61.98,28.83 62.56,29.41 67.61,29.41 69.06,30.86 69.34,30.86 69.85,30.86 82.68,30.86 89.92,38.1 XIOH.8
PD7
  Top 0.203: XIOL.16 88.01,27.94 81.66,21.59 60.3,21.59 60.3,21.57 59.69,20.95 59.69,20.57 58.17,19.05 58.04,19.05 57.4,18.41 56.9,18.41 56.8,18.51 IC3.50
PE0  (via drill 0.41)
  Top 0.203: PWML.1 61.47,48.77 59.69,48.77 58.04,47.12 52.83,47.12 51.18,45.47 45.59,45.47 44.58,44.45 41.91,44.45 40.39,42.93 40.39,36.7 v40.64,36.45 42.16,34.92 43.69,34.92 43.94,34.67 43.94,34.04 43.75,33.85 IC3.2
  Top 0.254: v30.61,37.97 30.54,37.9 30.54,36.12 31.11,35.56 31.11,32.38 29.46,30.73 28.63,30.73 RN4.2
  Bottom 0.203: v30.61,37.97 31.37,37.85
  Bottom 0.254: 31.37,37.85 39.24,37.85 v40.64,36.45
PE1  (via drill 0.41)
  Top 0.203: v40.39,35.18 39.88,35.69 39.88,43.05 41.91,45.09 44.45,45.09 45.34,45.97 50.8,45.97 52.45,47.62 57.78,47.62 59.44,49.28 60.96,49.28 PWML.2 | v39.62,33.53 39.88,33.27 39.95,33.35 IC3.3
  Top 0.254: RN4.1 29.91,29.91 31.62,31.62 31.62,36.32 v31.5,36.7
  Bottom 0.203: v40.39,35.18 40.39,34.29 v39.62,33.53
  Bottom 0.254: v31.5,36.7 38.73,36.7 v40.39,35.18
PE3  (via drill 0.41)
  Top 0.203: IC3.5 39.54,32.35 38.86,33.02 38.86,43.31 41.91,46.35 44.2,46.35 45.09,47.24 49.28,47.24 v49.4,47.37
  Bottom 0.203: v49.4,47.37 49.4,47.62 50.8,49.02 50.8,50.55 50.67,50.67 PWML.6
PE4
  Top 0.203: IC3.6 39.02,31.85 38.35,32.51 38.35,43.43 41.91,46.99 43.94,46.99 44.7,47.75 46.99,47.75 47.37,48.13 57.28,48.13 58.42,49.28 PWML.3
PE5
  Top 0.203: IC3.7 42.78,31.35 42.55,31.37 38.73,31.37 37.85,32.26 37.85,43.56 41.91,47.62 43.94,47.62 44.58,48.26 46.61,48.26 46.99,48.64 55.37,48.64 55.88,49.15 PWML.4
PG0  (via drill 0.41)
  Top 0.203: IC3.51 58.8,21.84 v59.05,21.46 | XIOL.13 95.25,24.13 88.14,24.13 84.07,20.07 71.75,20.07 71.25,19.56 70.36,18.67 70.1,18.41 59.69,18.41 59.44,18.67 v59.05,18.67
  Bottom 0.203: v59.05,18.67 v59.05,21.46
PG1  (via drill 0.41)
  Top 0.203: IC3.52 60.44,22.85 v60.83,22.48 | XIOL.14 88.14,25.4 83.31,20.57 71.12,20.57 69.6,19.05 60.33,19.05 59.94,19.43 v59.94,19.56
  Bottom 0.203: v59.94,19.56 60.58,19.56 61.34,20.32 61.34,21.97 v60.83,22.48
PG2  (via drill 0.41)
  Top 0.203: IC3.70 59.8,31.85 59.92,31.73 59.92,29.49 v60.33,29.08 | v60.58,20.7 61.09,20.7 61.47,21.08 82.55,21.08 88.14,26.67 95.25,26.67 XIOL.15
  Bottom 0.203: v60.58,20.7 60.2,20.7 59.94,20.95 59.94,28.57 v60.33,29.08
PG5  (via drill 0.41)
  Top 0.203: IC3.1 42.73,34.35 42.67,34.29 40.13,34.29 39.37,35.05 39.37,43.18 41.91,45.72 44.32,45.72 45.09,46.48 50.04,46.48 v50.67,47.12
  Bottom 0.203: PWML.5 53.34,48.64 52.58,47.88 51.44,47.88 v50.67,47.12
PH3
  Top 0.203: IC3.15 37.42,27.35 37.34,27.43 37.34,43.69 41.91,48.26 43.81,48.26 44.32,48.77 46.23,48.77 PWML.7
PH4
  Top 0.203: IC3.16 37.16,26.85 36.83,27.18 36.83,43.81 41.91,48.9 43.56,48.9 45.72,51.05 PWML.8
PH5
  Top 0.203: IC3.17 36.9,26.35 36.32,26.92 36.32,45.59 39.62,48.9 40.64,48.9 41.91,50.16 PWMH.1
PH6
  Top 0.203: PWMH.2 39.37,49.91 35.81,46.35 35.81,26.67 36.58,25.91 42.67,25.91 42.73,25.85 IC3.18
PL0
  Top 0.203: 49.28,20.3 49.28,14.22 51.18,12.32 90.3,12.32 91.95,13.97 95.25,13.97 XIOL.5
  Top 0.254: IC3.35 49.3,20.32 49.28,20.3
PL1
  Top 0.203: IC3.36 49.8,14.46 51.44,12.83 89.53,12.83 91.95,15.24 XIOL.6
PL2
  Top 0.203: 50.29,20.3 50.29,14.99 51.94,13.34 88.9,13.34 92.08,16.51 95.25,16.51 XIOL.7
  Top 0.254: IC3.37 50.27,20.32 50.29,20.3
PL3
  Top 0.203: IC3.38 50.8,15.49 52.45,13.84 88.27,13.84 92.2,17.78 XIOL.8
PL4
  Top 0.203: 51.31,20.22 51.31,15.75 52.7,14.35 87.63,14.35 92.33,19.05 95.25,19.05 XIOL.9
  Top 0.254: IC3.39 51.3,20.28 51.33,20.24 51.31,20.22
PL5
  Top 0.203: IC3.40 51.8,16.02 52.96,14.86 87,14.86 92.46,20.32 XIOL.10
PL6
  Top 0.203: 52.32,20.24 52.32,16.51 53.47,15.37 86.49,15.37 92.71,21.59 95.25,21.59 XIOL.11
  Top 0.254: IC3.41 52.3,20.32 52.27,20.3 52.32,20.24
PL7
  Top 0.203: IC3.42 52.8,17.05 53.98,15.88 85.72,15.88 92.71,22.86 XIOL.12
PWRIN
  Top 1.27: D1.A 15.44,12.06 X1.2
RD+
  Top 0.254: IC4.29 13.71,37.85 13.59,37.97 13.59,38.61 13.53,39.3 RN2.4
RD-
  Top 0.254: IC4.30 13.86,37.35 13.59,37.08 13.59,36.96 13.5,36.87 12.77,36.87 RN2.1
RESET  (via drill 0.41)  (1 unrouted)
  Top 0.254: 46.8,19.44 46.53,19.18 44.2,19.18 43.69,19.68 | 64.72,24.31 68.12,24.31 69.85,26.04 78.74,26.04 v80.01,27.3
  Top 0.305: POWER.1 33.02,7.24 v31.5,9.4 | 46.8,19.44 IC3.30 | ICSP.5 64.72,24.31 | RN1.1 79.97,39.08 80.9,40.01 82.55,40.01 82.68,40.13 84.2,40.13 84.45,39.88 84.45,33.78 82.8,32.13 v80.01,32.13 RESET.4 | 43.69,19.68 35.69,19.68 34.29,18.29 34.29,17.78 33.66,17.14 31.11,17.14 29.21,15.24 RESET-EN.2 | C7.2 28.79,17.36 27.94,16.51 27.3,16.51 27.3,15.37 RESET-EN.1 RESET-EN.2 | RESET-EN.2 28.57,15.11 28.57,13.55 C1.1 28.57,13.12 28.57,12.7 28.11,12.23 27.09,12.23 v26.54,11.68
  Top 0.406: v46.85,8.26 47.88,8.26 48.51,7.62 49.53,7.62 49.78,7.87 51.05,7.87 52.96,9.78 72.14,9.78 73.28,8.64 78.49,8.64 v78.61,8.76
  Bottom 0.254: 63.75,25.27 64.26,24.77 64.26,17.78 66.67,15.37
  Bottom 0.305: v78.61,8.76 78.11,8.76 77.98,8.64 74.93,8.64 68.2,15.37 66.67,15.37 | 63.75,25.27 ICSP.5 | v46.85,8.26 46.1,9.02 32,9.02 v31.5,9.4 28.83,9.4 v26.54,11.68 | v80.01,27.3 v80.01,32.13
RESET2  (via drill 0.41)
  Top 0.305: v16.95,41.59 16.51,41.15 16.51,40.43 IC4.24 | v16.95,41.59 17.02,41.66 | ICSP1.5 14.1,45.85 14.1,44.32 16.26,42.16 16.38,42.16 v16.95,41.59 | RN5.8 16.58,15.31 v16.51,15.24
  Bottom 0.305: v16.95,41.59 16.64,41.27 16.64,41.15 22.86,34.92 22.86,29.84 20.95,27.94 20.95,25.4 16.76,21.21 16.76,15.24 v16.51,15.24
RXD1  (via drill 0.41)
  Top 0.203: IC3.45 54.33,20.35 54.36,20.32 54.36,18.29 55.3,17.35 71.96,17.35 v72.64,17.91
  Bottom 0.203: COMMUNICATION.3 81.28,42.67 74.17,35.56 74.17,19.56 v72.64,17.91
RXD2  (via drill 0.41)
  Top 0.203: IC3.12 41.04,28.85 v41.02,28.83
  Bottom 0.203: v41.02,28.83 41.02,30.1 42.67,31.75 42.67,37.08 43.43,37.85 43.43,38.99 42.67,39.75 42.67,43.94 43.94,45.21 51.18,45.21 51.94,45.97 55.63,45.97 56.26,45.34 60.45,45.34 63.5,48.39 63.96,48.39 64.85,49.28 67.13,49.28 68.02,48.39 73.66,48.39 74.04,48.77 75.69,48.77 76.2,49.28 COMMUNICATION.5
RXD3  (via drill 0.41)
  Top 0.203: COMMUNICATION.7 71.12,49.28 70.61,48.77 67.69,48.77 66.8,47.75 v66.8,47.37 | v55.75,29.72 55.75,29.46 56.9,28.32 58.8,28.32 IC3.63
  Bottom 0.203: v66.8,47.37 66.8,46.99 55.45,35.51 55.45,33.6 56.13,32.89 56.26,32.89 56.77,32.38 56.77,31.11 56.39,30.73 56.01,30.73 55.63,30.35 55.63,29.84 v55.75,29.72
RXL
  Top 0.254: IC4.10 24.24,36.85 RX.C
SCK2
  Top 0.254: IC4.15 21.19,39.35 21.84,40.01 21.84,41.15 20.7,42.29 20.7,43.31 19.56,44.45 19.56,46.23 ICSP1.3
SCL  (via drill 0.41)
  Top 0.203: IC3.43 53.3,17.31 54.23,16.38 74.68,16.38 75.06,16.76 v75.31,16.89
  Top 0.254: 80.54,37.23 80.64,37.34 80.64,38.86
  Top 0.305: v81.41,39.12 80.9,39.12 80.64,38.86 | 80.54,37.23 RN1.2
  Bottom 0.203: v75.31,16.89 75.18,17.02 75.18,34.29 80.01,39.12 v81.41,39.12 81.41,40.77 83.82,43.18 83.82,46.99 85.72,48.9 86.36,48.9 COMMUNICATION.1
SDA  (via drill 0.41)
  Top 0.203: v74.04,17.65 73.28,16.89 54.48,16.89 53.85,17.53 53.85,19.94 53.8,20.04 53.8,20.14 IC3.44
  Top 0.305: v78.74,38.99 78.74,36.83 79.12,36.45 79.95,36.45 RN1.3
  Bottom 0.203: v74.04,17.65 74.04,18.67 74.68,19.3 74.68,34.92 v78.74,38.99 82.55,42.8 82.55,48.26 83.82,49.53 COMMUNICATION.2
TXD1  (via drill 0.41)
  Top 0.203: IC3.46 54.8,20.26 54.86,20.19 54.86,18.67 55.63,17.91 70.74,17.91 v72.01,19.18
  Bottom 0.203: COMMUNICATION.4 78.74,42.55 73.66,37.47 73.66,20.07 72.64,19.18 v72.01,19.18
TXD2  (via drill 0.41)
  Top 0.203: IC3.13 41.81,28.35 41.4,27.94 39.88,27.94 39.75,28.07 v39.75,28.83
  Bottom 0.203: v39.75,28.83 39.75,29.59 42.16,32 42.16,37.21 42.93,37.97 42.93,38.86 42.16,39.62 42.16,44.2 43.69,45.72 51.05,45.72 51.94,46.61 55.88,46.61 56.52,45.97 60.45,45.97 63.37,48.9 63.88,48.9 64.77,49.78 67.21,49.78 68.1,48.9 73.15,48.9 73.66,49.53 COMMUNICATION.6
TXD3  (via drill 0.41)
  Top 0.203: COMMUNICATION.8 67.06,50.8 66.42,50.16 66.42,48.51 v65.28,47.37 | IC3.64 58.66,28.85 58.55,28.83 57.66,28.83 57.28,29.21 57.28,30.35 v55.75,31.88
  Bottom 0.203: v65.28,47.37 65.28,46.23 54.97,35.89 54.97,32.66 v55.75,31.88
TXL
  Top 0.254: IC4.11 26.28,37.35 TX.C
UGND
  Top 0.305: IC4.28 15.12,38.35 14.61,38.35 14.35,38.61
  Top 0.61: L1.1 11.01,43.56 C10.2 11.09,43.14 11.86,42.34 13.77,42.34 14.35,41.78 14.35,38.61
  Top 0.813: X2.4 6.5,36.83 5.08,36.83 4.45,37.47 4.45,40.51 7.75,43.81 8.76,43.81 9.27,44.32 9.27,45.13 L1.1
  Bottom 0.813: X2.4 6.52,36.53 GROUND.1
USBVCC
  Top 0.305: IC4.31 14.37,36.85 14.22,36.7
  Top 0.406: 14.22,36.7 14.22,34.92 12.95,33.66 12.7,33.66 10.16,31.11 10.16,28.57 12.06,26.67 12.06,25.38
  Top 0.61: F1.1 8.48,25.4 T2.1 12.06,25.38 14.37,25.38 C8.1
USHIELD  (via drill 0.41)
  Top 0.813: X2.P$2 3.81,33.02 5.08,33.02 5.71,33.66 9.79,33.66 Z1.1 | Z2.1 10.18,41.26 10.05,41.26 9.65,41.66 v9.65,42.67 | L1.2 4.92,45.21 X2.P$1
  Bottom 0.813: v9.65,42.67 5.49,42.67 X2.P$1
  Bottom 1.27: X2.P$2 3.81,33.02 1.91,34.92 1.91,41.27 3.81,43.18 X2.P$1
VIN  (via drill 0.41)
  Top 0.203: IC2.3 11.77,20.06 IC1.3
  Top 0.305: RN5.6 16.91,16.91 16.51,16.51 14.61,16.51
  Top 0.406: 17.78,13.97 17.74,14.01
  Top 0.61: IC2.3 12.32,20.06 14.61,17.78 C2.1 14.61,17.57 14.61,16.51 14.61,15.24 15.88,13.97 17.78,13.97 19.68,13.97 20.61,13.04 D1.C
  Top 1.27: v24,7.37 23.25,8.12 PC1.+ 20.32,11.13 D1.C
  Bottom 1.27: v24,7.37 24.38,7.87 43.81,7.87 45.72,5.97 POWER.6
VUCAP
  Top 0.305: IC4.27 15.12,38.85 15.11,38.86 15.11,42.16 13.84,43.43 13.17,43.43 C10.1
XT1
  Top 0.254: Y2.3 17.29,29.99 16.51,29.21 16.51,28.36 C16.1 R2.1
  Top 0.305: Y2.3 Q1.2 15.75,31.88 15.24,32.38 15.24,33.4 R4.2
XT1R
  Top 0.305: IC4.1 16.54,33.88 R4.1
XT2
  Top 0.254: R2.2 C17.1 20.74,28.79 19.29,30.24 Y2.1 19.29,31.89 17.78,33.66 17.78,34.04 17.02,34.8 17.02,35.78 IC4.2
  Top 0.305: Y2.1 Q1.1
XTAL1
  Top 0.203: R1.1 R3.2
  Top 0.254: Q2.2 Y1.3 37.83,13.61 38.73,12.7 39.59,12.7 C14.2 R1.1
XTAL1R
  Top 0.203: IC3.34 48.8,18.8 47.53,17.53 42.55,17.53 41.91,16.89 R3.1
XTAL2
  Top 0.203: IC3.33 48.3,19.18 47.05,17.93 43.41,17.93 43.05,18.29 41.78,18.29 40.39,16.89 C15.2
  Top 0.254: Q2.1 Y1.1 37.83,15.61 38.73,16.51 39.59,16.51 C15.2 R1.2
XVCC
  Top 0.61: F1.2 2.5,25.45 1.52,26.42 1.52,34.54 1.91,34.92 6.59,34.92 X2.1
(copper drawn outside any net)
  shapes: Top area x1

### Text on the board
Top: Arduino Mega 2560 Reference Design | Reference Designs ARE PROVIDED "AS IS" AND "WITH ALL FAULTS. Arduino DISCLAIMS ALL OTHER WARRANTIES, EXPRESS OR IMPLIED, / REGARDING PRODUCTS, INCLUDING BUT NOT LIMITED TO, ANY IMPLIED WARRANTIES OF MERCHANTABILITY OR FITNESS FOR A PARTICULAR PURPOSE | Arduino may make changes to specifications and product descriptions at any time, without notice. The Customer must not / rely on the absence or characteristics of any features or instructions marked "reserved" or "undefined." Arduino reserves / these for future definition and shall have no responsibility whatsoever for conflicts or incompatibilities arising from future changes to them. / The product information on the Web Site or Materials is subject to change without notice. Do not finalize a design with this information.
tPlace: 9 | 8 | 7 | 6 | 5 | 4 | 3 | 2 | 1 | 0 | 22 | 14 | 15 | 16 | 17 | 18 | 19 | 20 | 21 | 13 | 12 | 11 | 10 | 24 | 26 | 28 | 30 | 31 | 32 | 33 | 34 | 35 | 36 | 37 | 38 | 39 | 40 | 41 | 42 | 43 | www.arduino.cc | 44 | 45 | 46 | 47 | TM | 48 | 49 | 50 | 51 | 52 | 53 | 0 | 1 | 2 | 3 | 4 | 5 | 6 | 7 | 8 | 9 | 10 | 11 | 12 | 13 | 14 | 15
tNames: M.Banzi | 5V | D.Cuartielles | T.Igoe | MADE IN | G.Martino | D.Mellis | ITALY | GND | AREF | PWM | TX | RX | TX3 | RX3 | TX2 | RX2 | TX1 | RX1 | SDA | SCL | 1 | DIGITAL | Arduino | MEGA 2560 | ANALOG IN | GND | MEGAXL | RESET | 3V3 | 5V | GND | VIN
bNames: MADE IN | designed by | ITALY | tinker it
ReferenceLC: L | TX | RX | PC1 | PC2